# Altium project Pedal_MB.PrjPcb (part 1 of 4)
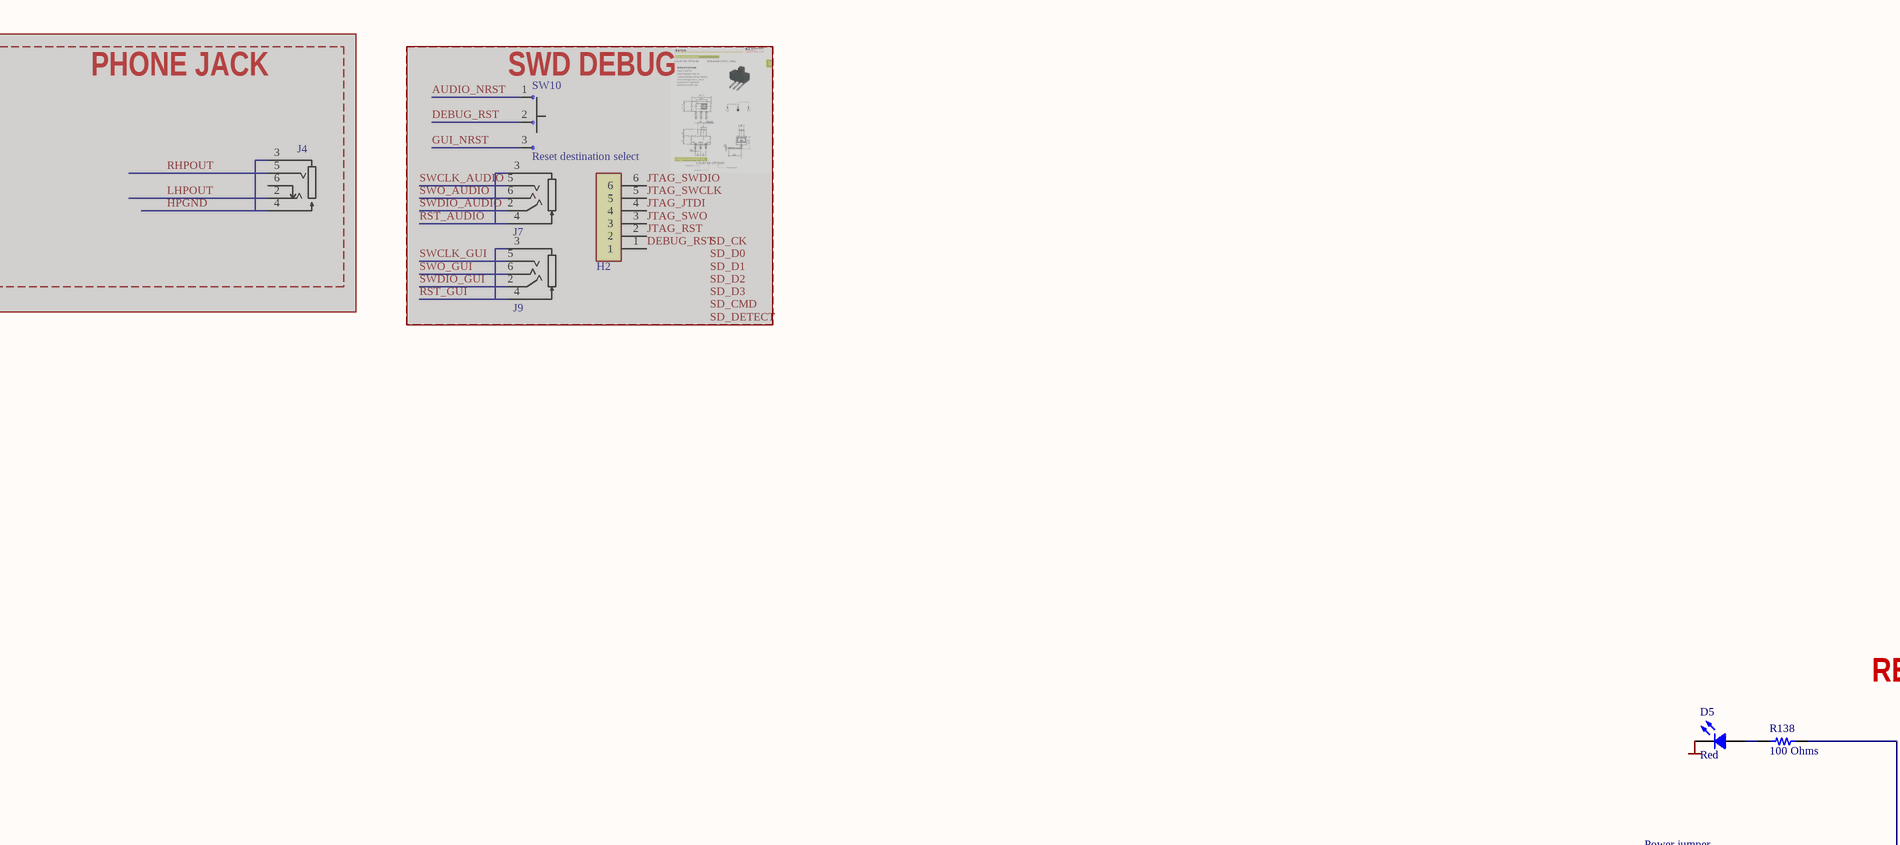
[diagram p0: 3d_dsn_approx.SchDoc, top left]
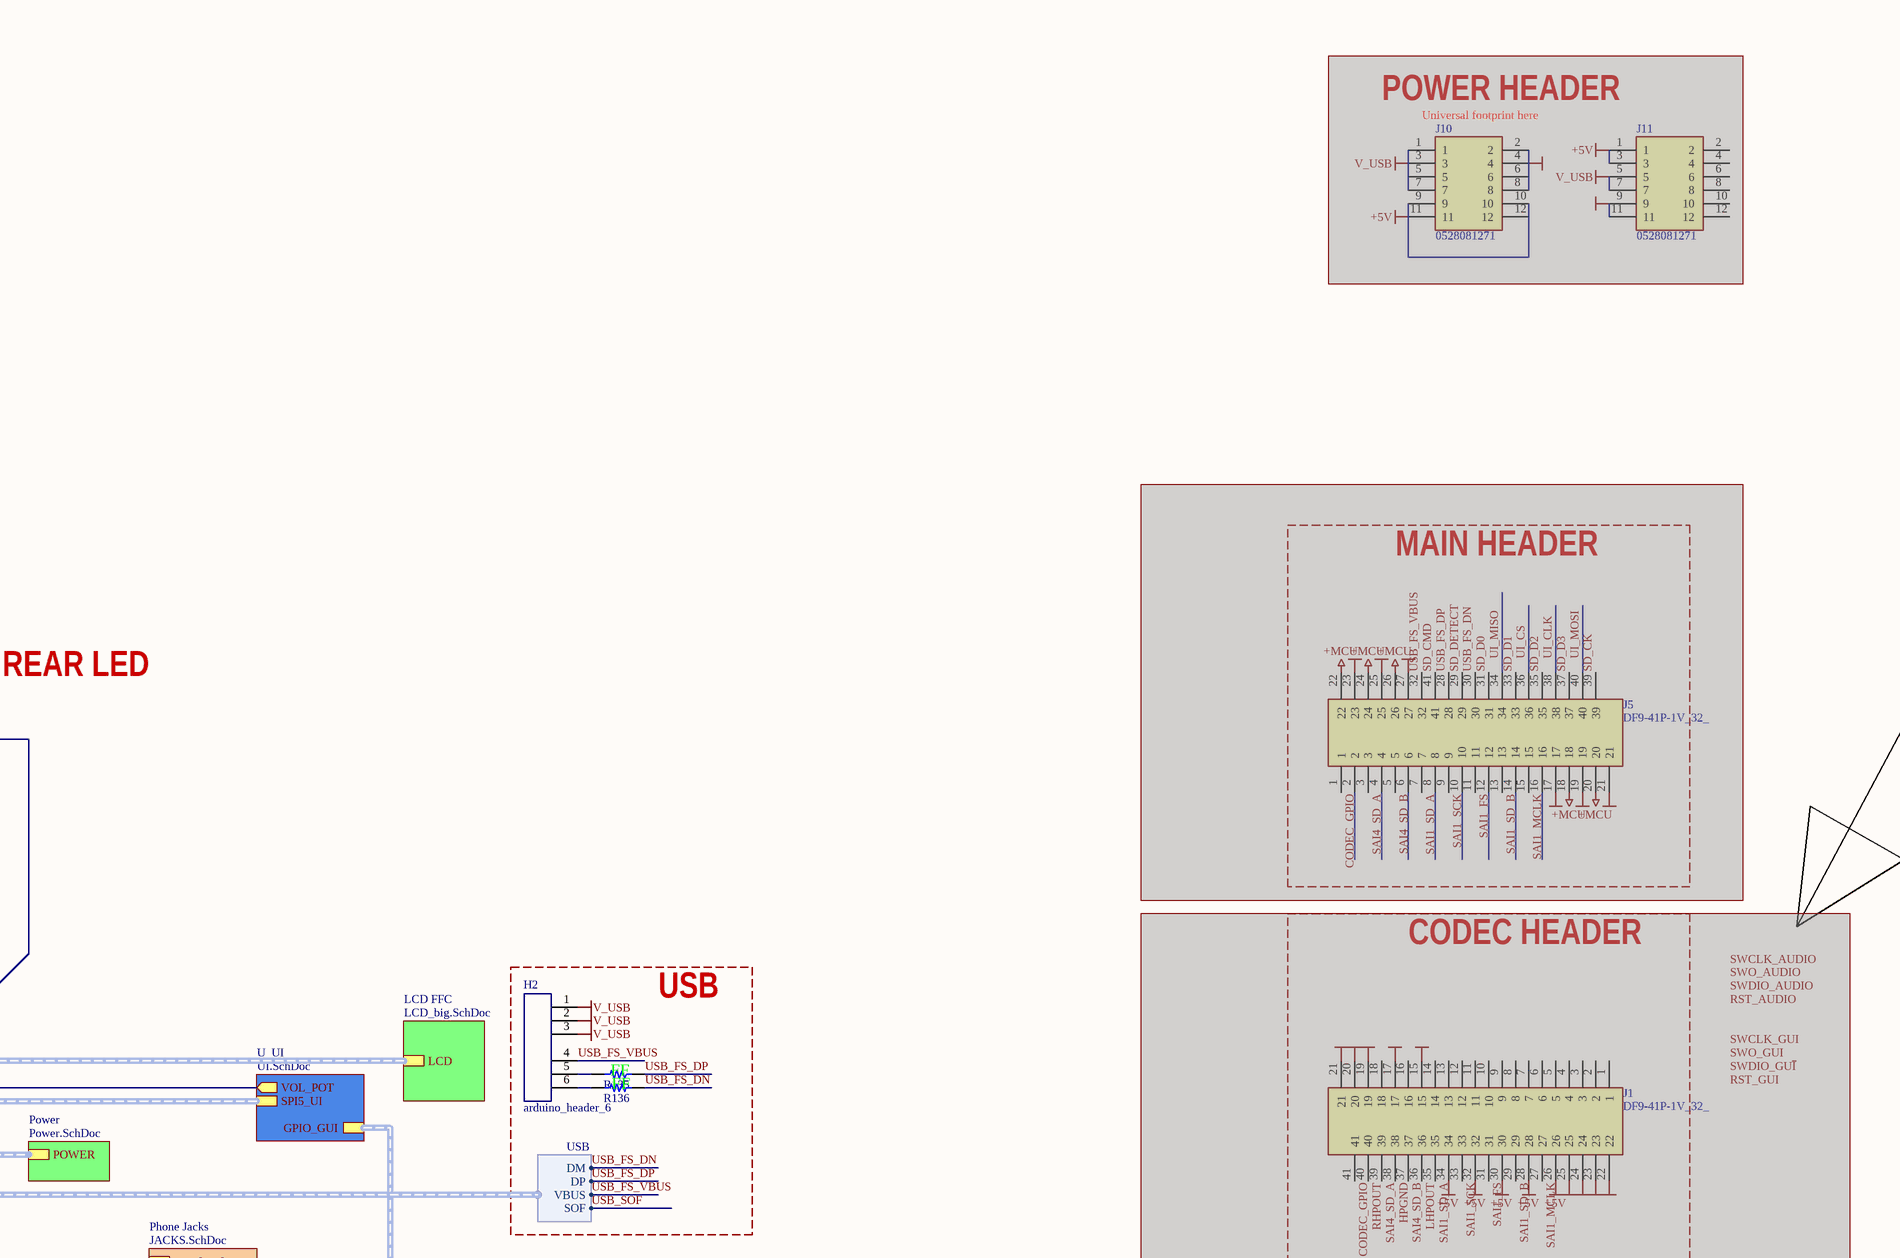
[diagram p1: 3d_dsn_approx.SchDoc, top right]
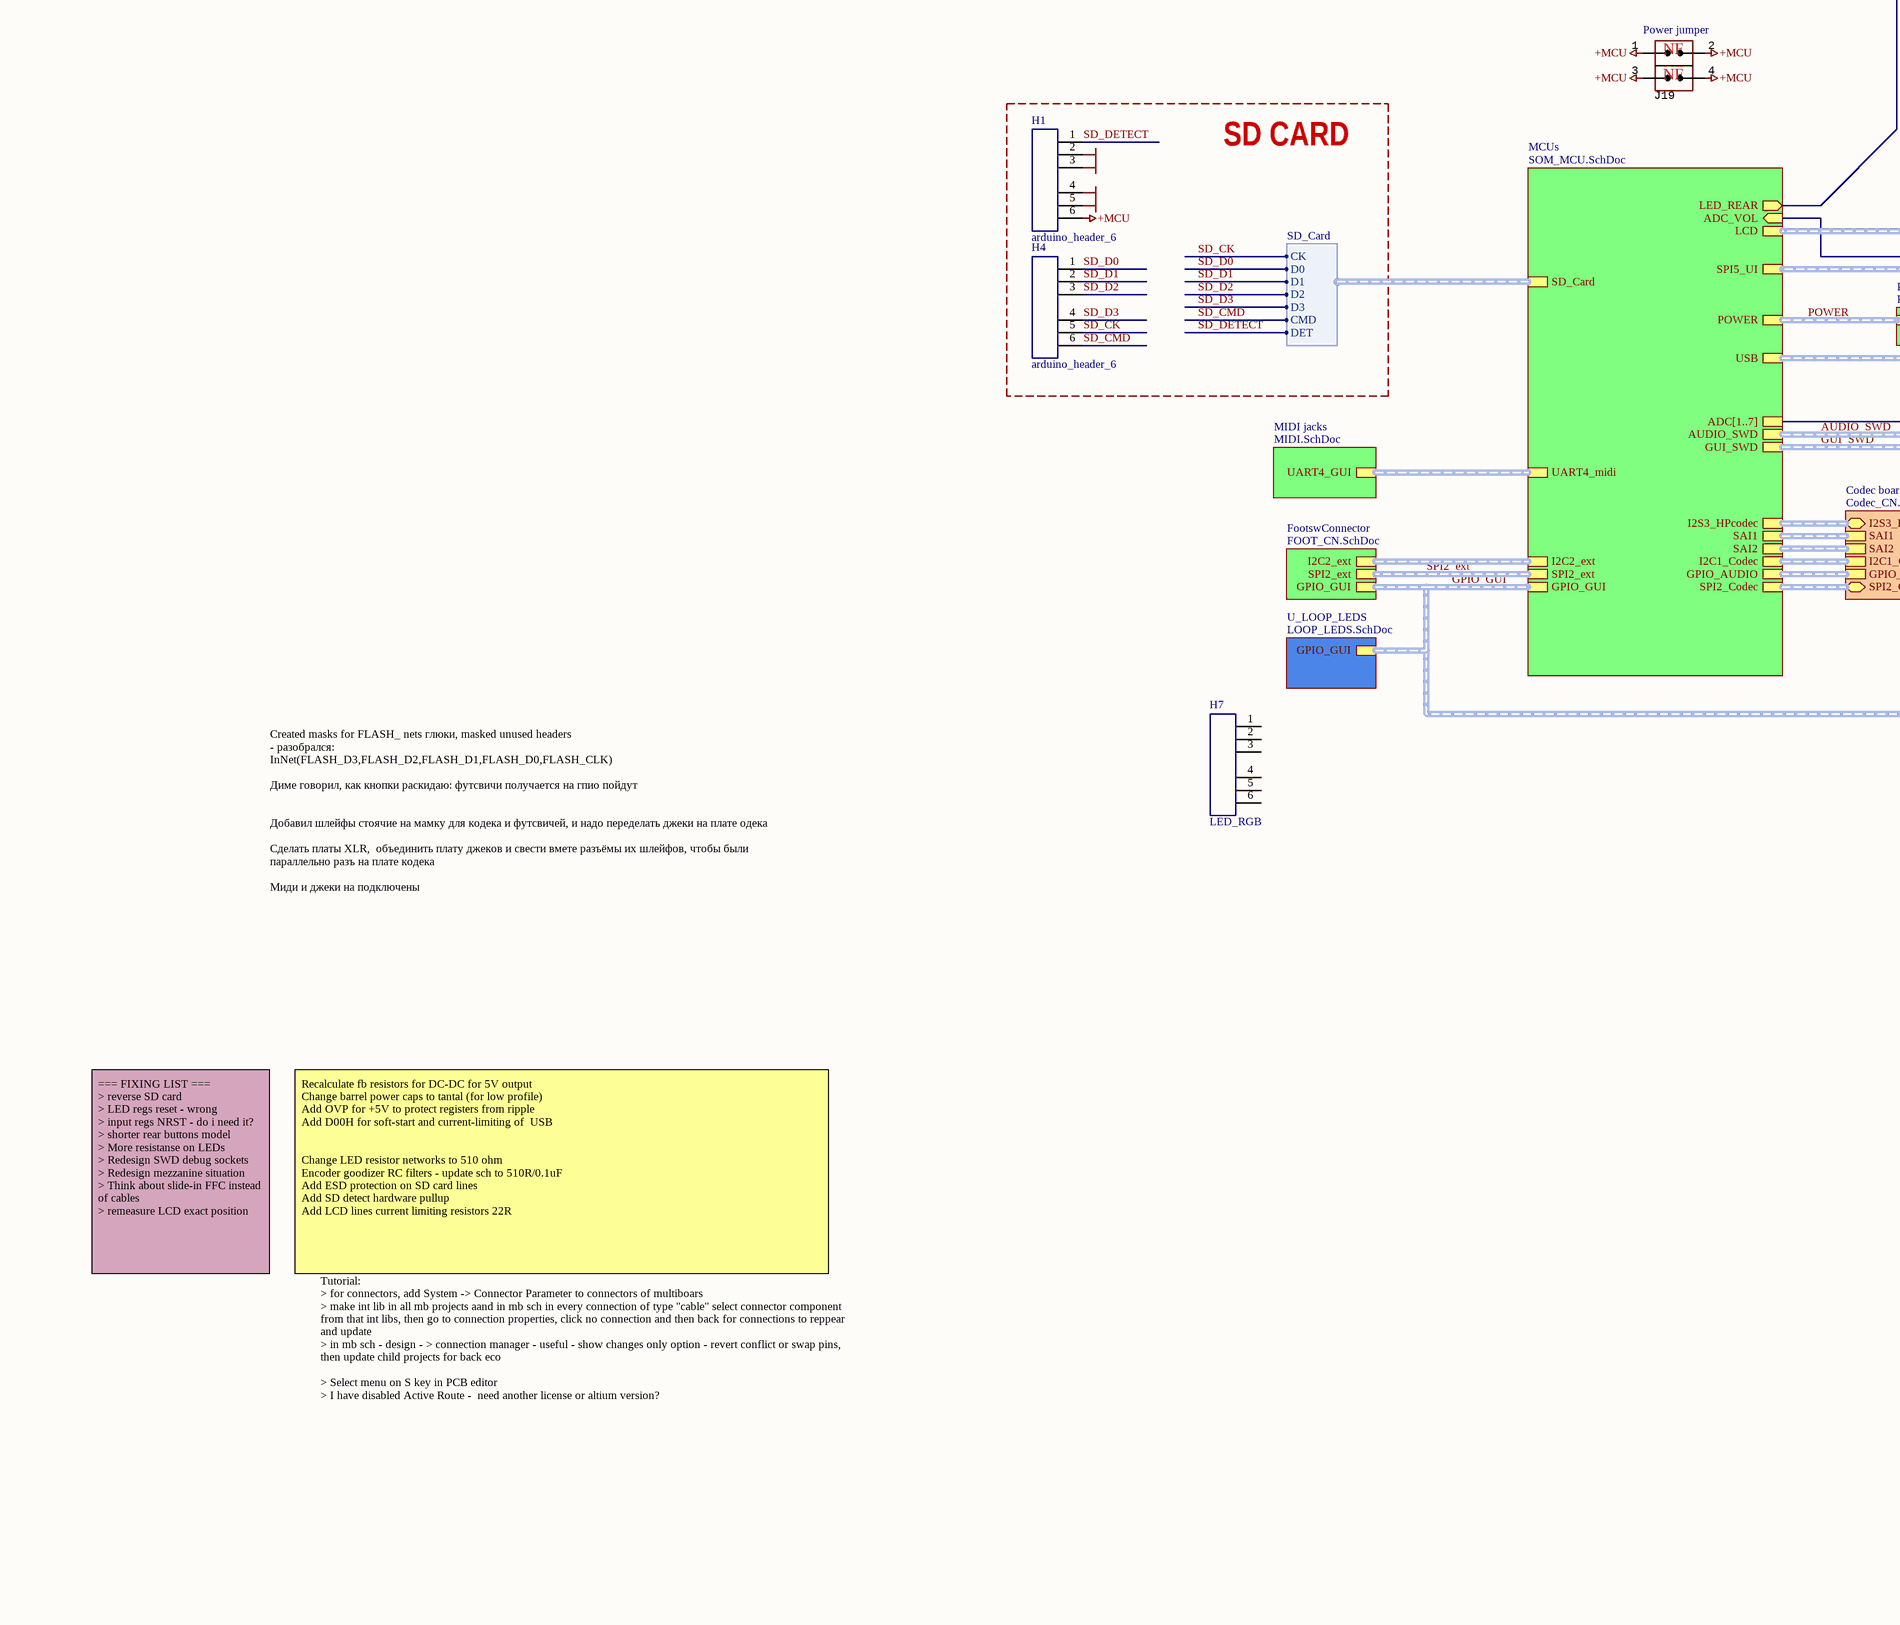
[diagram p2: 3d_dsn_approx.SchDoc, bottom left]
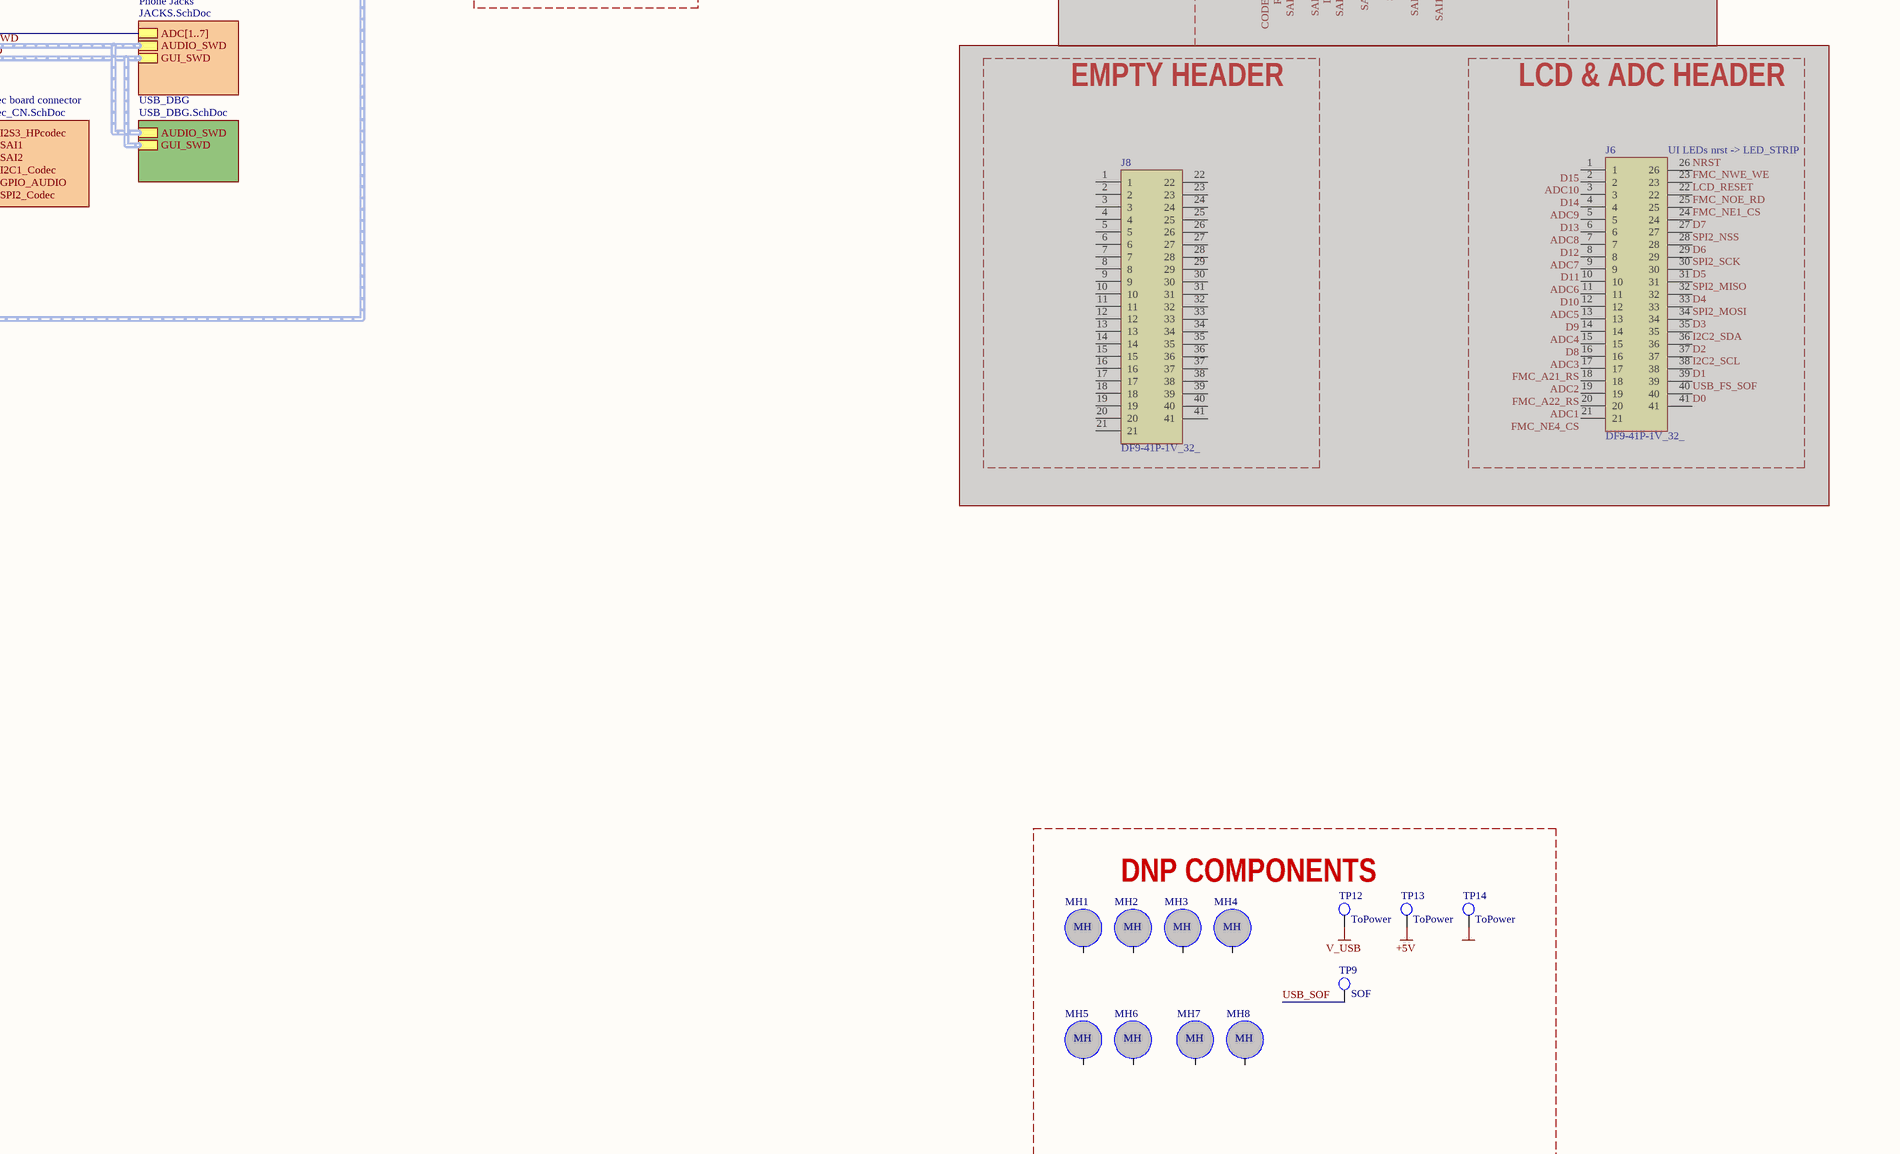
[diagram p3: 3d_dsn_approx.SchDoc, bottom right]
15 sheets, 430 parts. Net scope: hierarchical (ports join the sheet entries above them; power ports are global).
Board files: main.PcbDoc, main_old.PcbDoc
Sheets:
  3d_dsn_approx.SchDoc
    MCUs = SOM_MCU.SchDoc
      MCU_GUI = MCU_GUI.SchDoc
      MCU_AUDIO = MCU_AUDIO.SchDoc
      SPI_LSH = MISO_LSH.SchDoc
    LCD FFC = LCD_big.SchDoc
    FootswConnector = FOOT_CN.SchDoc
    Codec board connector = Codec_CN.SchDoc
    MIDI jacks = MIDI.SchDoc
    Phone Jacks = JACKS.SchDoc
    USB_DBG = USB_DBG.SchDoc
    Power = Power.SchDoc
    U_UI = UI.SchDoc
      IC101 = 74VHCT14AM1.SchDoc
      IC102 = 74VHCT14AM1.SchDoc
      IC103 = 74VHCT14AM1.SchDoc
      IC104 = 74VHCT14AM1.SchDoc
      IC105 = 74VHCT14AM1.SchDoc
    U_LOOP_LEDS = LOOP_LEDS.SchDoc

## Sheet 3d_dsn_approx.SchDoc
size A1; SheetNumber: 1; SheetTotal: 13

### Parts
(Parts that share a designator on the sheet are numbered #1, #2 ... from top to bottom, then left to right.)
D5  Red  [LED 0805_2012 RED]
H1#1  arduino_header_6  [header-6_female]
H2#1  1.5-6A  [1.5-6A]  (value not drawn)  (masked out: inside a compile mask, not in the netlist)
H2#2  arduino_header_6  [header-6_female]
H4  arduino_header_6  [header-6_female]
H7  LED_RGB  [header-6_male]
J1#1  DF9-41P-1V_32_  [HIROSE_DF9-41P-1V(32)]  (masked out: inside a compile mask, not in the netlist)
J4#1  35RASMT2BHNTRX  [PJ_327]  (value not drawn)  (masked out: inside a compile mask, not in the netlist)
J5#1  DF9-41P-1V_32_  [HIROSE_DF9-41P-1V(32)]  (masked out: inside a compile mask, not in the netlist)
J6#1  DF9-41P-1V_32_  [HIROSE_DF9-41P-1V(32)]  (masked out: inside a compile mask, not in the netlist)
J7#1  PJ-327F  [PJ-327F]  (value not drawn)  (masked out: inside a compile mask, not in the netlist)
J8#1  DF9-41P-1V_32_  [HIROSE_DF9-41P-1V(32)]  (masked out: inside a compile mask, not in the netlist)
J9#1  PJ-327F  [PJ-327F]  (value not drawn)  (masked out: inside a compile mask, not in the netlist)
J10#1  0528081271  [AFA11-S12GLA-00]  (masked out: inside a compile mask, not in the netlist)
J11#1  0528081271  [AFA11-S12GLA-00]  (masked out: inside a compile mask, not in the netlist)
J19  (no value)  [CON: JUMPER x2]
MH1  MountingHole  [Hole_2.5mm]  (value not drawn)
MH2  MountingHole  [Hole_2.5mm]  (value not drawn)
MH3  MountingHole  [Hole_2.5mm]  (value not drawn)
MH4  MountingHole  [Hole_2.5mm]  (value not drawn)
MH5  MountingHole  [Hole_2.5mm]  (value not drawn)
MH6  MountingHole  [Hole_2.5mm]  (value not drawn)
MH7  MountingHole  [Hole_2.5mm]  (value not drawn)
MH8  MountingHole  [Hole_2.5mm]  (value not drawn)
R135  (no value)  [RES 0603_1608]
R136  (no value)  [RES 0603_1608]
R138  100 Ohms  [RES 0402_1005]
SW10  Reset destination select  [SLIDE_SW_BIG]  (masked out: inside a compile mask, not in the netlist)
TP9  SOF  [TESTPOINT_PAD]
TP12  ToPower  [TESTPOINT_PAD]
TP13  ToPower  [TESTPOINT_PAD]
TP14  ToPower  [TESTPOINT_PAD]

### Blocks framed on the sheet
PHONE JACK: J4#1
SWD DEBUG: H2#1 J7#1 J9#1 SW10
MAIN HEADER: J5#1
CODEC HEADER: J1#1
SD CARD: H1#1 H4
USB: H2#2 R135 R136
EMPTY HEADER: J8#1
LCD & ADC HEADER: J6#1
DNP COMPONENTS: MH1-MH8 TP9 TP12-TP14

### Sub-sheets
Codec board connector = Codec_CN.SchDoc: SAI1 (harness SAI), SAI2 (harness SAI), I2C1_Codec (harness I2C), GPIO_AUDIO (harness GPIO_AUDIO), I2S3_HPcodec (bidir), SPI2_Codec (bidir)
FootswConnector = FOOT_CN.SchDoc: I2C2_ext (harness I2C), SPI2_ext (harness GPIO_GUI), GPIO_GUI (harness GPIO_GUI)
LCD FFC = LCD_big.SchDoc: LCD (harness LCD)
MCUs = SOM_MCU.SchDoc: SD_Card (harness SD_Card), LCD (harness LCD), I2C2_ext (harness GPIO_GUI), SPI2_ext (harness GPIO_GUI), SPI5_UI (harness USB), USB (harness USB), SAI1, SAI2, I2C1_Codec, GPIO_AUDIO, UART4_midi (harness SD_Card), GUI_SWD (harness SWD), AUDIO_SWD (harness SWD), GPIO_GUI (harness GPIO_GUI), POWER (harness POWER), ADC[1..7], ADC_VOL (in), LED_REAR (out), I2S3_HPcodec, SPI2_Codec
MIDI jacks = MIDI.SchDoc: UART4_GUI (harness UART)
Phone Jacks = JACKS.SchDoc: GUI_SWD (harness SWD), AUDIO_SWD (harness SWD), ADC[1..7]
Power = Power.SchDoc: POWER (harness POWER)
U_LOOP_LEDS = LOOP_LEDS.SchDoc: GPIO_GUI (harness GPIO_GUI)
U_UI = UI.SchDoc: VOL_POT (out), SPI5_UI (harness USB), GPIO_GUI (harness GPIO_GUI)
USB_DBG = USB_DBG.SchDoc: GUI_SWD (harness SWD), AUDIO_SWD (harness SWD)

### Harnesses
SD_Card: CK, D0, D1, D2, D3, CMD, DET
USB: DM, DP, VBUS, SOF

### Nets
+5V: TP13.1
+MCU: H1#1.6 J19.1(IN) J19.2(IN) J19.3(IN) J19.4(IN)
GND: D5.2 H1#1.2 H1#1.3 H1#1.4 H1#1.5 TP14.1
V_USB: H2#2.1 H2#2.2 H2#2.3 TP12.1
ADC_VOL: sheet MCUs/ADC_VOL, sheet U_UI/VOL_POT
LED_REAR: R138.2 ; sheet MCUs/LED_REAR
SD_CK: H4.5 ; sheet MCUs/SD_Card.CK
SD_CMD: H4.6 ; sheet MCUs/SD_Card.CMD
SD_D0: H4.1 ; sheet MCUs/SD_Card.D0
SD_D1: H4.2 ; sheet MCUs/SD_Card.D1
SD_D2: H4.3 ; sheet MCUs/SD_Card.D2
SD_D3: H4.4 ; sheet MCUs/SD_Card.D3
SD_DETECT: H1#1.1 ; sheet MCUs/SD_Card.DET
USB_FS_DN: R136.1 ; sheet MCUs/USB.DM  [project net USB_FS_DM]
USB_FS_DP: R135.1 ; sheet MCUs/USB.DP
USB_FS_VBUS: H2#2.4 ; sheet MCUs/USB.VBUS
USB_SOF: TP9.1 ; sheet MCUs/USB.SOF  [project net USB_FS_SOF]
NetD5_1: D5.1 R138.1
NetH2#2_5: H2#2.5 R135.2
NetH2#2_6: H2#2.6 R136.2

Not connected (* = marked no-connect by the designer): H7 1 2 3 4 5 6; MH1 0; MH2 0; MH3 0; MH4 0; MH5 0; MH6 0; MH7 0; MH8 0

### Buses and harness runs
bus sheet MCUs/ADC[1..7] = sheet Phone Jacks/ADC[1..7]
harness AUDIO_SWD = sheet MCUs/AUDIO_SWD = sheet Phone Jacks/AUDIO_SWD = sheet USB_DBG/AUDIO_SWD
harness GPIO_GUI = sheet FootswConnector/GPIO_GUI = sheet MCUs/GPIO_GUI = sheet U_LOOP_LEDS/GPIO_GUI = sheet U_UI/GPIO_GUI
harness GUI_SWD = sheet MCUs/GUI_SWD = sheet Phone Jacks/GUI_SWD = sheet USB_DBG/GUI_SWD
harness POWER = sheet MCUs/POWER = sheet Power/POWER
harness sheet Codec board connector/GPIO_AUDIO = sheet MCUs/GPIO_AUDIO
harness sheet Codec board connector/I2C1_Codec = sheet MCUs/I2C1_Codec
harness sheet Codec board connector/I2S3_HPcodec = sheet MCUs/I2S3_HPcodec
harness sheet Codec board connector/SAI1 = sheet MCUs/SAI1
harness sheet Codec board connector/SAI2 = sheet MCUs/SAI2
harness sheet Codec board connector/SPI2_Codec = sheet MCUs/SPI2_Codec
harness sheet FootswConnector/I2C2_ext = sheet MCUs/I2C2_ext
harness sheet LCD FFC/LCD = sheet MCUs/LCD
harness sheet MCUs/SPI5_UI = sheet U_UI/SPI5_UI
harness sheet MCUs/UART4_midi = sheet MIDI jacks/UART4_GUI
harness SPI2_ext = sheet FootswConnector/SPI2_ext = sheet MCUs/SPI2_ext

### Notes on the sheet
- POWER HEADER
- (near J10#1) Universal footprint here
- REAR LED
- (near J19) Power jumper
- (near J19) NF
- (near R135) FF
- FF
- (near J6#1) UI LEDs nrst -> LED_STRIP
- Created masks for FLASH_ nets глюки, masked unused headers
  - разобрался:
  InNet(FLASH_D3,FLASH_D2,FLASH_D1,FLASH_D0,FLASH_CLK)
  Диме говорил, как кнопки раскидаю: футсвичи получается на гпио пойдут
  Добавил шлейфы стоячие на мамку для кодека и футсвичей, и надо переделать джеки на плате одека
  Сделать платы XLR,  объединить плату джеков и свести вмете разъёмы их шлейфов, чтобы были параллельно разъ на плате кодека
  Миди и джеки на подключены
- Recalculate fb resistors for DC-DC for 5V output
  Change barrel power caps to tantal (for low profile)
  Add OVP for +5V to protect registers from ripple
  Add D00H for soft-start and current-limiting of  USB
  Change LED resistor networks to 510 ohm
  Encoder goodizer RC filters - update sch to 510R/0.1uF
  Add ESD protection on SD card lines
  Add SD detect hardware pullup
  Add LCD lines current limiting resistors 22R
- Tutorial:
  > for connectors, add System -> Connector Parameter to connectors of multiboars
  > make int lib in all mb projects aand in mb sch in every connection of type "cable" select connector component from that int libs, then go to connection properties, click no connection and then back for connections to reppear and update
  > in mb sch - design - > connection manager - useful - show changes only option - revert conflict or swap pins, then update child projects for back eco
  > Select menu on S key in PCB editor
  > I have disabled Active Route -  need another license or altium version?
- (in symbol MountingHole) MH

### Library data of the parts
D5 = LSM0805412V: LED RED CLEAR 0805 SMD; Manufacturer: Visual Communications Company - VCC; Configuration: 0805; Current - Test: 20mA; Lens Color: Colorless; Lens Size: 1.40mm x 1.20mm; Lens Style: Rectangle with Flat Top; Millicandela Rating: 100mcd; Viewing Angle: 120°; Voltage - Forward (Vf) (Typ): 2V; Wavelength - Dominant: 625nm; Part Number: LSM0805412V; Color: Red; ComponentLink1Description: Datasheet; ComponentLink1URL: https://www.vcclite.com/wp-content/uploads/wpallimport/files/files/LSM0805452V-Green-Datasheet.pdf; ComponentLink2Description: DigiKey Link; ComponentLink2URL: https://www.digikey.com/en/products/detail/visual-communications-company-vcc/LSM0805412V/10229616; Device Package: 0805 (2012 Metric); Height (Max): 0.90mm; LastUpdated: 6/3/2024 8:00:06 PM; Lens Transparency: Clear; Lifecycle Status: Active; Minimum Order: 1; Mounting Type: Surface Mount; Package / Case: 0805 (2012 Metric); Packaging: TapeAndReel; PartId: 336; Part Status: Active; Price: 0.11; Series: LSM0805; Size / Dimension: 2.00mm L x 1.25mm W; Supplier 1: DigiKey; Supplier Part Number 1: 28-LSM0805412VCT-ND; Supplier Device Package: 0805; Value: Red; Wavelength - Peak: 625nm
H1#1 H2#2 H4 H7 = arduino_header_6: System: Connector
H2#1 = 1.5-6A: Pin Header p=1.5mm, 6 pins
J1#1 J5#1 J6#1 J8#1 = DF9-41P-1V_32_: Connector; Manufacturer_Name: Hirose; Manufacturer_Part_Number: DF9-41P-1V(32); Datasheet Link: http://componentsearchengine.com/Datasheets/1/DF9-41P-1V(32).pdf; Mouser Part Number: 798-DF9-41P-1V32; Mouser Price/Stock: https://www.mouser.co.uk/ProductDetail/Hirose-Connector/DF9-41P-1V32?qs=zOgoZG1CgI%252BzVCgniEkwOw%3D%3D; Arrow Part Number: DF9-41P-1V(32); Arrow Price/Stock: https://www.arrow.com/en/products/df9-41p-1v-32/hirose-electric
J4#1 = 3.5mm jack stereo smd: Conn 3.5MM Stereo Jack F 3 POS Solder RA SMD 3 Terminal 1 Port T/R; MF: Switchcraft; MP: 35RASMT2BHNTRX; Package: None; Price: 0.84 USD; Availability: Good; SnapEDA_Link: https://www.snapeda.com/parts/35RASMT2BHNTRX/Switchcraft%20Inc./view-part/?ref=snap; Value: *
J7#1 J9#1 = 3.5mm jack 4pos smd: PJ-327F 4 contacts 5 pins 1 sw
J10#1 J11#1 = 0528081271: Connector; Manufacturer_Name: Molex; Datasheet Link: https://www.molex.com/pdm_docs/sd/528082071_sd.pdf; Height: 5.3mm; Manufacturer_Part_Number: 0528081271; System: Connector
J19 = Jumper_double: CommentText: "Перемычка"
R135 R136 = RCA06030000ZSEA: RES SMD 0 OHM JUMPER 1/10W 0603; Manufacturer: Vishay Dale; Power (Watts): 0.1W, 1/10W; Part Number: RCA06030000ZSEA; ComponentLink1Description: Datasheet; ComponentLink1URL: http://www.vishay.com/docs/20037/rcae3.pdf; ComponentLink2Description: DigiKey Link; ComponentLink2URL: http://digikey.com/product-detail/en/vishay-dale/RCA06030000ZSEA/541-2192-1-ND/4946845; Composition: Thick Film; Device Package: 0603 (1608 Metric); Features: Anti-Sulfur, Automotive AEC-Q200; Height - Seated (Max): 0.020" (0.50mm); LastUpdated: 9/2/2020 1:10:23 AM; Lifecycle Status: Active; Minimum Order: 1; Number of Terminations: 2; Operating Temperature: -55°C ~ 155°C; Package / Case: 0603 (1608 Metric); Packaging: TapeAndReel; PartId: 5740; Part Status: Active; Price: 0.01; Ratings: AEC-Q200; Series: RCA; Size / Dimension: 0.061" L x 0.033" W (1.55mm x 0.85mm); Supplier 1: DigiKey; Supplier Part Number 1: 541-2192-1-ND; Supplier Device Package: 0603; Tolerance: Jumper
R138 = CRCW0402100RFKEE: RES SMD 100 OHM 1% 1/16W 0402; Manufacturer: Vishay Dale; Power (Watts): 0.063W, 1/16W; Temperature Coefficient: ±100ppm/°C; Part Number: CRCW0402100RFKEE; Value: 100 Ohms; ComponentLink1Description: Datasheet; ComponentLink1URL: http://www.vishay.com/docs/20035/dcrcwe3.pdf; ComponentLink2Description: DigiKey Link; ComponentLink2URL: https://www.digikey.com/en/products/detail/vishay-dale/CRCW0402100RFKEE/5069886; Composition: Thick Film; Device Package: 0402 (1005 Metric); Height - Seated (Max): 0.016" (0.40mm); LastUpdated: 2/9/2024 8:30:05 PM; Lifecycle Status: Active; Minimum Order: 1; Number of Terminations: 2; Operating Temperature: -55°C ~ 155°C; Package / Case: 0402 (1005 Metric); Packaging: CutTape; PartId: 6830; Part Status: Active; Price: 0.01; Resistance: 100 Ohms; Series: CRCW; Size / Dimension: 0.039" L x 0.020" W (1.00mm x 0.50mm); Supplier 1: DigiKey; Supplier Part Number 1: 541-2953-1-ND; Supplier Device Package: 0402; Tolerance: ±1%; Features: Automotive AEC-Q200; Ratings: AEC-Q200
SW10 = RockerSwitch_3mm: Slide switch L-KLS7-SS-12F19-G5
TP9 TP12-TP14 = TestPoint

## Sheet SOM_MCU.SchDoc
size A3; SheetNumber: 5; SheetTotal: 13
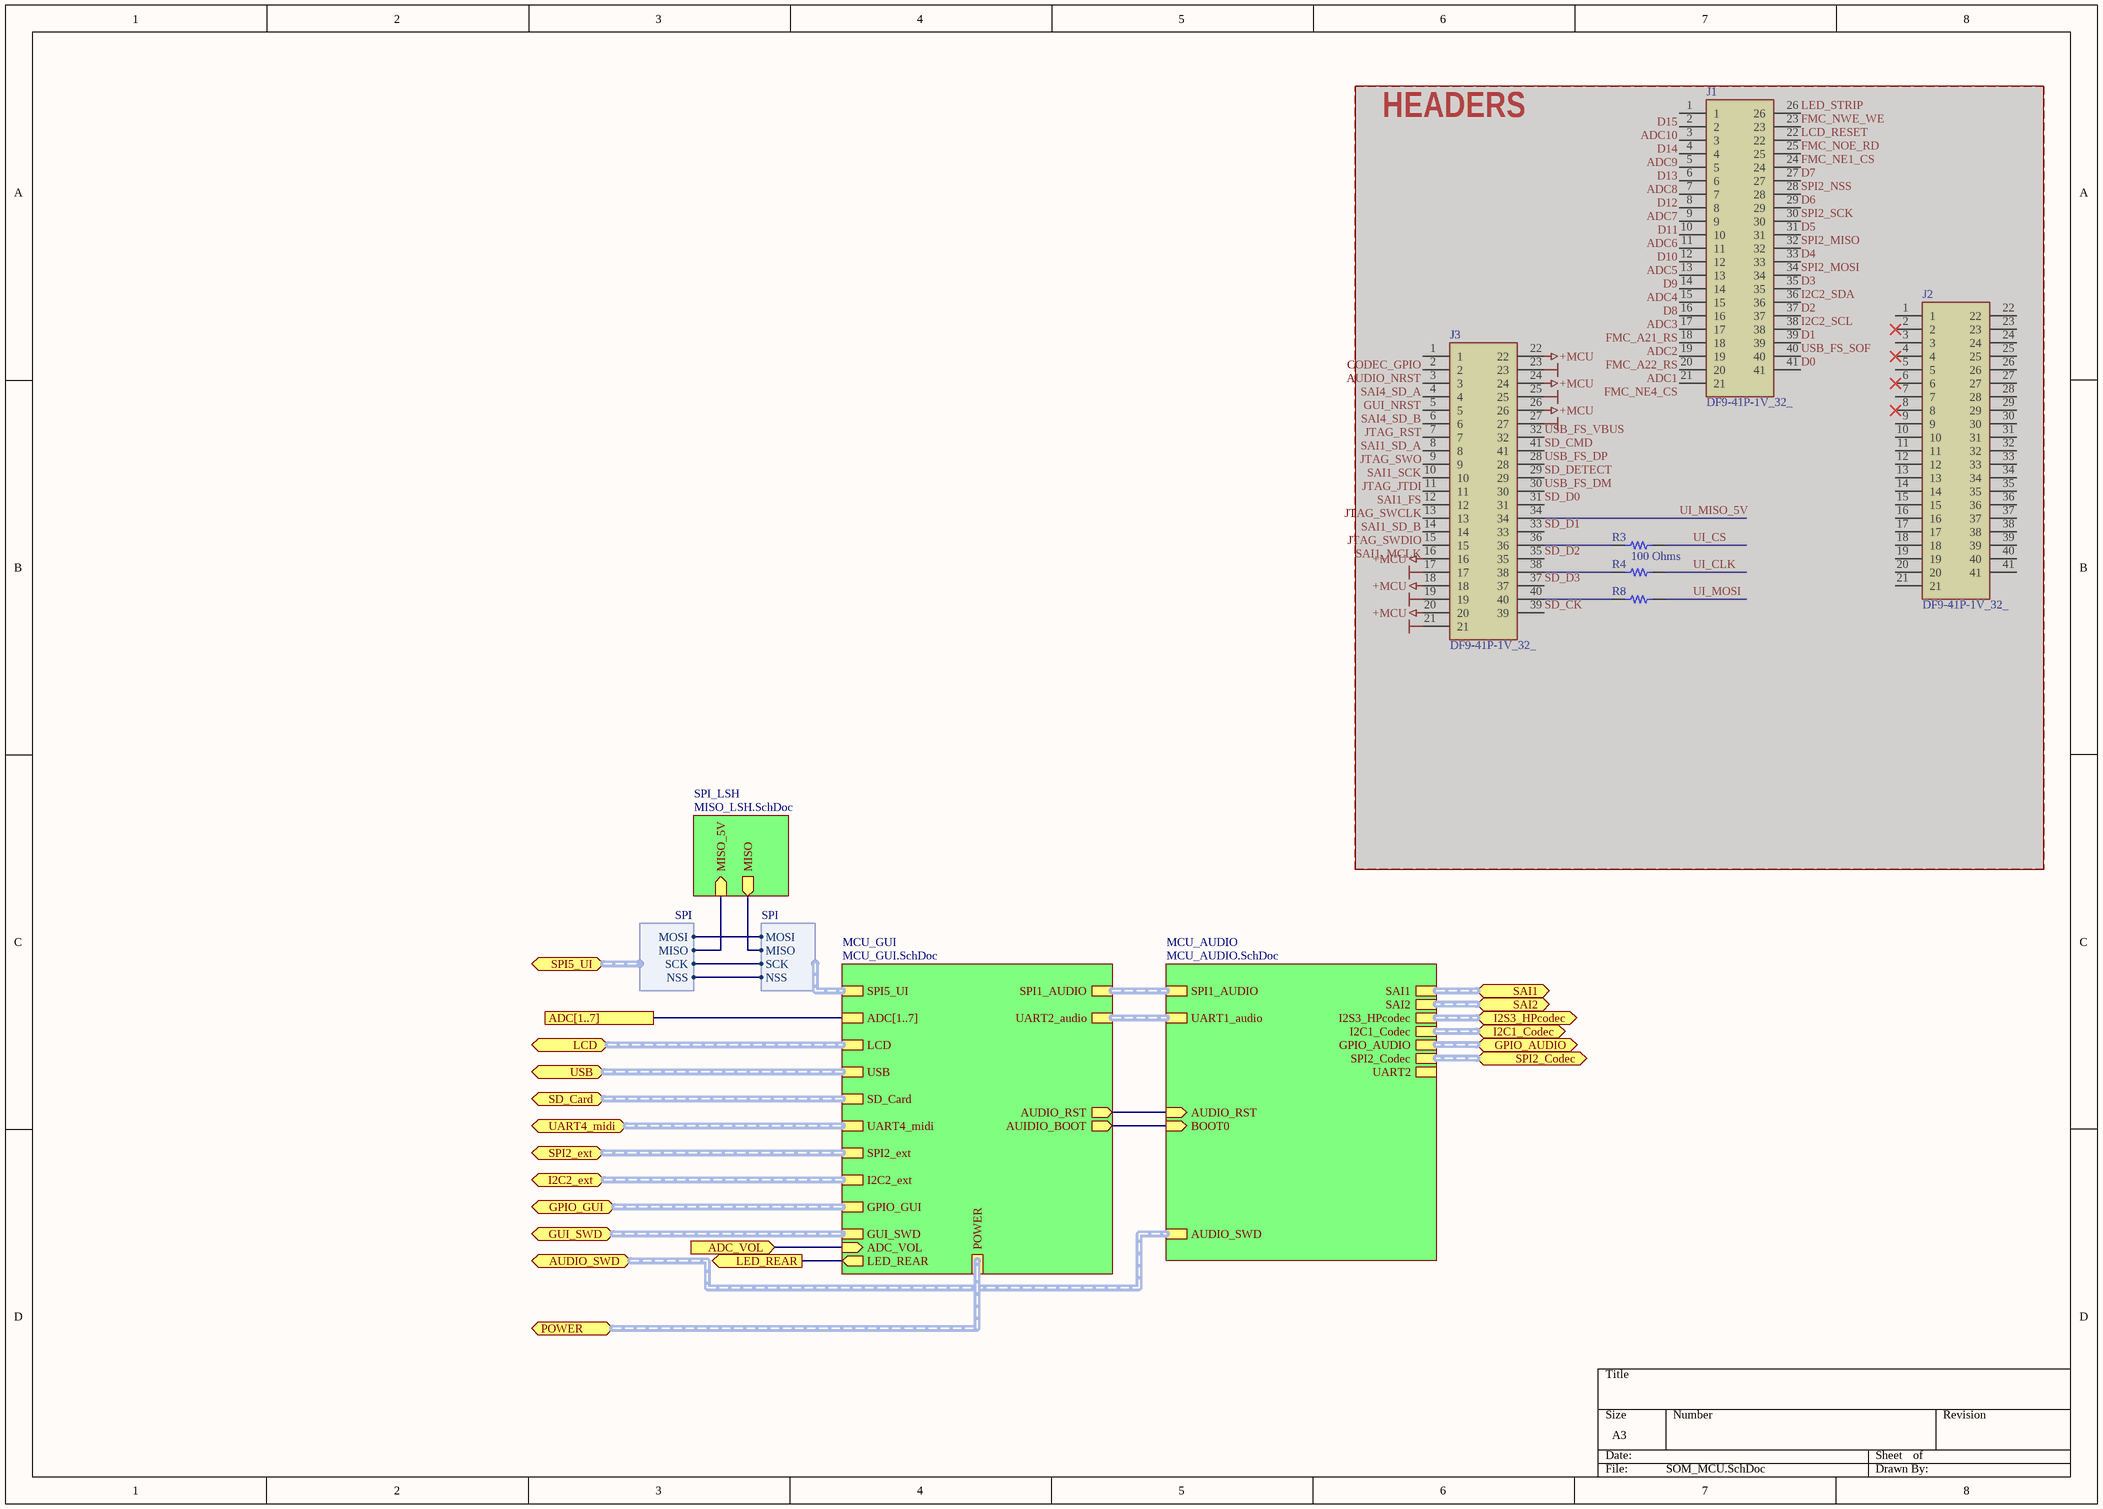
[diagram p4: SOM_MCU.SchDoc]

### Parts
(Parts that share a designator on the sheet are numbered #1, #2 ... from top to bottom, then left to right.)
J1#2  DF9-41P-1V_32_  [HIROSE_DF9-41P-1V(32)]  (masked out: inside a compile mask, not in the netlist)
J2#1  DF9-41P-1V_32_  [HIROSE_DF9-41P-1V(32)]  (masked out: inside a compile mask, not in the netlist)
J3#1  DF9-41P-1V_32_  [HIROSE_DF9-41P-1V(32)]  (masked out: inside a compile mask, not in the netlist)
R3#1  100 Ohms  [RES 0402_1005]  (masked out: inside a compile mask, not in the netlist)
R4#1  100 Ohms  [RES 0402_1005]  (value not drawn)  (masked out: inside a compile mask, not in the netlist)
R8#1  100 Ohms  [RES 0402_1005]  (value not drawn)  (masked out: inside a compile mask, not in the netlist)

### Blocks framed on the sheet
HEADERS: J1#2 J2#1 J3#1 R3#1 R4#1 R8#1

### Sub-sheets
MCU_AUDIO = MCU_AUDIO.SchDoc: I2C1_Codec (harness I2C), SPI1_AUDIO (harness SPI), SAI1 (harness SAI), GPIO_AUDIO (harness GPIO_AUDIO), SAI2 (harness SAI), UART1_audio (harness UART), BOOT0 (in), AUDIO_SWD (harness SWD), AUDIO_RST (in), I2S3_HPcodec (harness SAI), UART2 (harness UART), SPI2_Codec (harness SPI)
MCU_GUI = MCU_GUI.SchDoc: LCD (harness LCD), USB (harness USB), SD_Card (harness SD_Card), SPI1_AUDIO (harness SPI), SPI5_UI (harness SPI), UART2_audio (harness UART), SPI2_ext (harness SPI), I2C2_ext (harness I2C), GPIO_GUI (harness GPIO_GUI), AUDIO_RST (out), AUIDIO_BOOT (out), UART4_midi (harness UART), GUI_SWD (harness SWD), POWER (harness POWER), ADC[1..7], ADC_VOL (in), LED_REAR (out)
SPI_LSH = MISO_LSH.SchDoc: MISO_5V (in), MISO (out)

### Ports
ADC[1..7], ADC_VOL (in), AUDIO_SWD (bidir, harness SWD), GPIO_AUDIO (bidir), GPIO_GUI (bidir, harness GPIO_GUI), GUI_SWD (bidir, harness SWD), I2C1_Codec (bidir), I2C2_ext (bidir, harness I2C), I2S3_HPcodec (bidir), LCD (bidir, harness LCD), LED_REAR (out), POWER (bidir, harness POWER), SAI1 (bidir), SAI2 (bidir), SD_Card (bidir, harness SD_Card), SPI2_Codec (bidir), SPI2_ext (bidir, harness SPI), SPI5_UI (bidir, harness SPI), UART4_midi (bidir, harness SD_Card), USB (bidir, harness USB)

### Harnesses
SPI: MOSI, MISO, SCK, NSS

### Nets
ADC_VOL: port ADC_VOL, sheet MCU_GUI/ADC_VOL
AUDIO_BOOT: sheet MCU_GUI/AUIDIO_BOOT, sheet MCU_AUDIO/BOOT0
AUDIO_RST: sheet MCU_GUI/AUDIO_RST, sheet MCU_AUDIO/AUDIO_RST
LED_REAR: port LED_REAR, sheet MCU_GUI/LED_REAR
SPI5_MISO: sheet SPI_LSH/MISO, sheet MCU_GUI/SPI5_UI.MISO
SPI5_MOSI: sheet MCU_GUI/SPI5_UI.MOSI, port SPI5_UI.MOSI
SPI5_NSS: sheet MCU_GUI/SPI5_UI.NSS, port SPI5_UI.NSS
SPI5_SCK: sheet MCU_GUI/SPI5_UI.SCK, port SPI5_UI.SCK
UI_MISO: sheet SPI_LSH/MISO_5V, port SPI5_UI.MISO

### Buses and harness runs
bus port ADC[1..7] = sheet MCU_GUI/ADC[1..7]
harness port AUDIO_SWD = sheet MCU_AUDIO/AUDIO_SWD
harness port GPIO_AUDIO = sheet MCU_AUDIO/GPIO_AUDIO
harness port GPIO_GUI = sheet MCU_GUI/GPIO_GUI
harness port GUI_SWD = sheet MCU_GUI/GUI_SWD
harness port I2C1_Codec = sheet MCU_AUDIO/I2C1_Codec
harness port I2C2_ext = sheet MCU_GUI/I2C2_ext
harness port I2S3_HPcodec = sheet MCU_AUDIO/I2S3_HPcodec
harness port LCD = sheet MCU_GUI/LCD
harness port POWER = sheet MCU_GUI/POWER
harness port SAI1 = sheet MCU_AUDIO/SAI1
harness port SAI2 = sheet MCU_AUDIO/SAI2
harness port SD_Card = sheet MCU_GUI/SD_Card
harness port SPI2_Codec = sheet MCU_AUDIO/SPI2_Codec
harness port SPI2_ext = sheet MCU_GUI/SPI2_ext
harness port UART4_midi = sheet MCU_GUI/UART4_midi
harness port USB = sheet MCU_GUI/USB
harness sheet MCU_AUDIO/SPI1_AUDIO = sheet MCU_GUI/SPI1_AUDIO
harness sheet MCU_AUDIO/UART1_audio = sheet MCU_GUI/UART2_audio

### Library data of the parts
J1#2 J2#1 J3#1 = DF9-41P-1V_32_: as J1#1 on sheet 3d_dsn_approx; Datasheet Link: http://componentsearchengine.com/Datasheets/1/DF9-41P-1V(32).pdf; Mouser Part Number: 798-DF9-41P-1V32; Mouser Price/Stock: https://www.mouser.co.uk/ProductDetail/Hirose-Connector/DF9-41P-1V32?qs=zOgoZG1CgI%252BzVCgniEkwOw%3D%3D; Arrow Part Number: DF9-41P-1V(32); Arrow Price/Stock: https://www.arrow.com/en/products/df9-41p-1v-32/hirose-electric
R3#1 R4#1 R8#1 = CRCW0402100RFKEE: as R138 on sheet 3d_dsn_approx; Part Number: CRCW0402100RFKEE; Value: 100 Ohms; ComponentLink1Description: Datasheet; ComponentLink1URL: http://www.vishay.com/docs/20035/dcrcwe3.pdf; ComponentLink2Description: DigiKey Link; ComponentLink2URL: https://www.digikey.com/en/products/detail/vishay-dale/CRCW0402100RFKEE/5069886; Composition: Thick Film; Device Package: 0402 (1005 Metric); Height - Seated (Max): 0.016" (0.40mm); LastUpdated: 2/9/2024 8:30:05 PM; Lifecycle Status: Active; Minimum Order: 1; Number of Terminations: 2; Operating Temperature: -55°C ~ 155°C; Package / Case: 0402 (1005 Metric); Packaging: CutTape; PartId: 6830; Part Status: Active; Price: 0.01; Resistance: 100 Ohms; Series: CRCW; Size / Dimension: 0.039" L x 0.020" W (1.00mm x 0.50mm); Supplier 1: DigiKey; Supplier Part Number 1: 541-2953-1-ND; Supplier Device Package: 0402; Tolerance: ±1%; Features: Automotive AEC-Q200; Ratings: AEC-Q200

## Sheet MCU_GUI.SchDoc
size A1; SheetNumber: 6; SheetTotal: 13
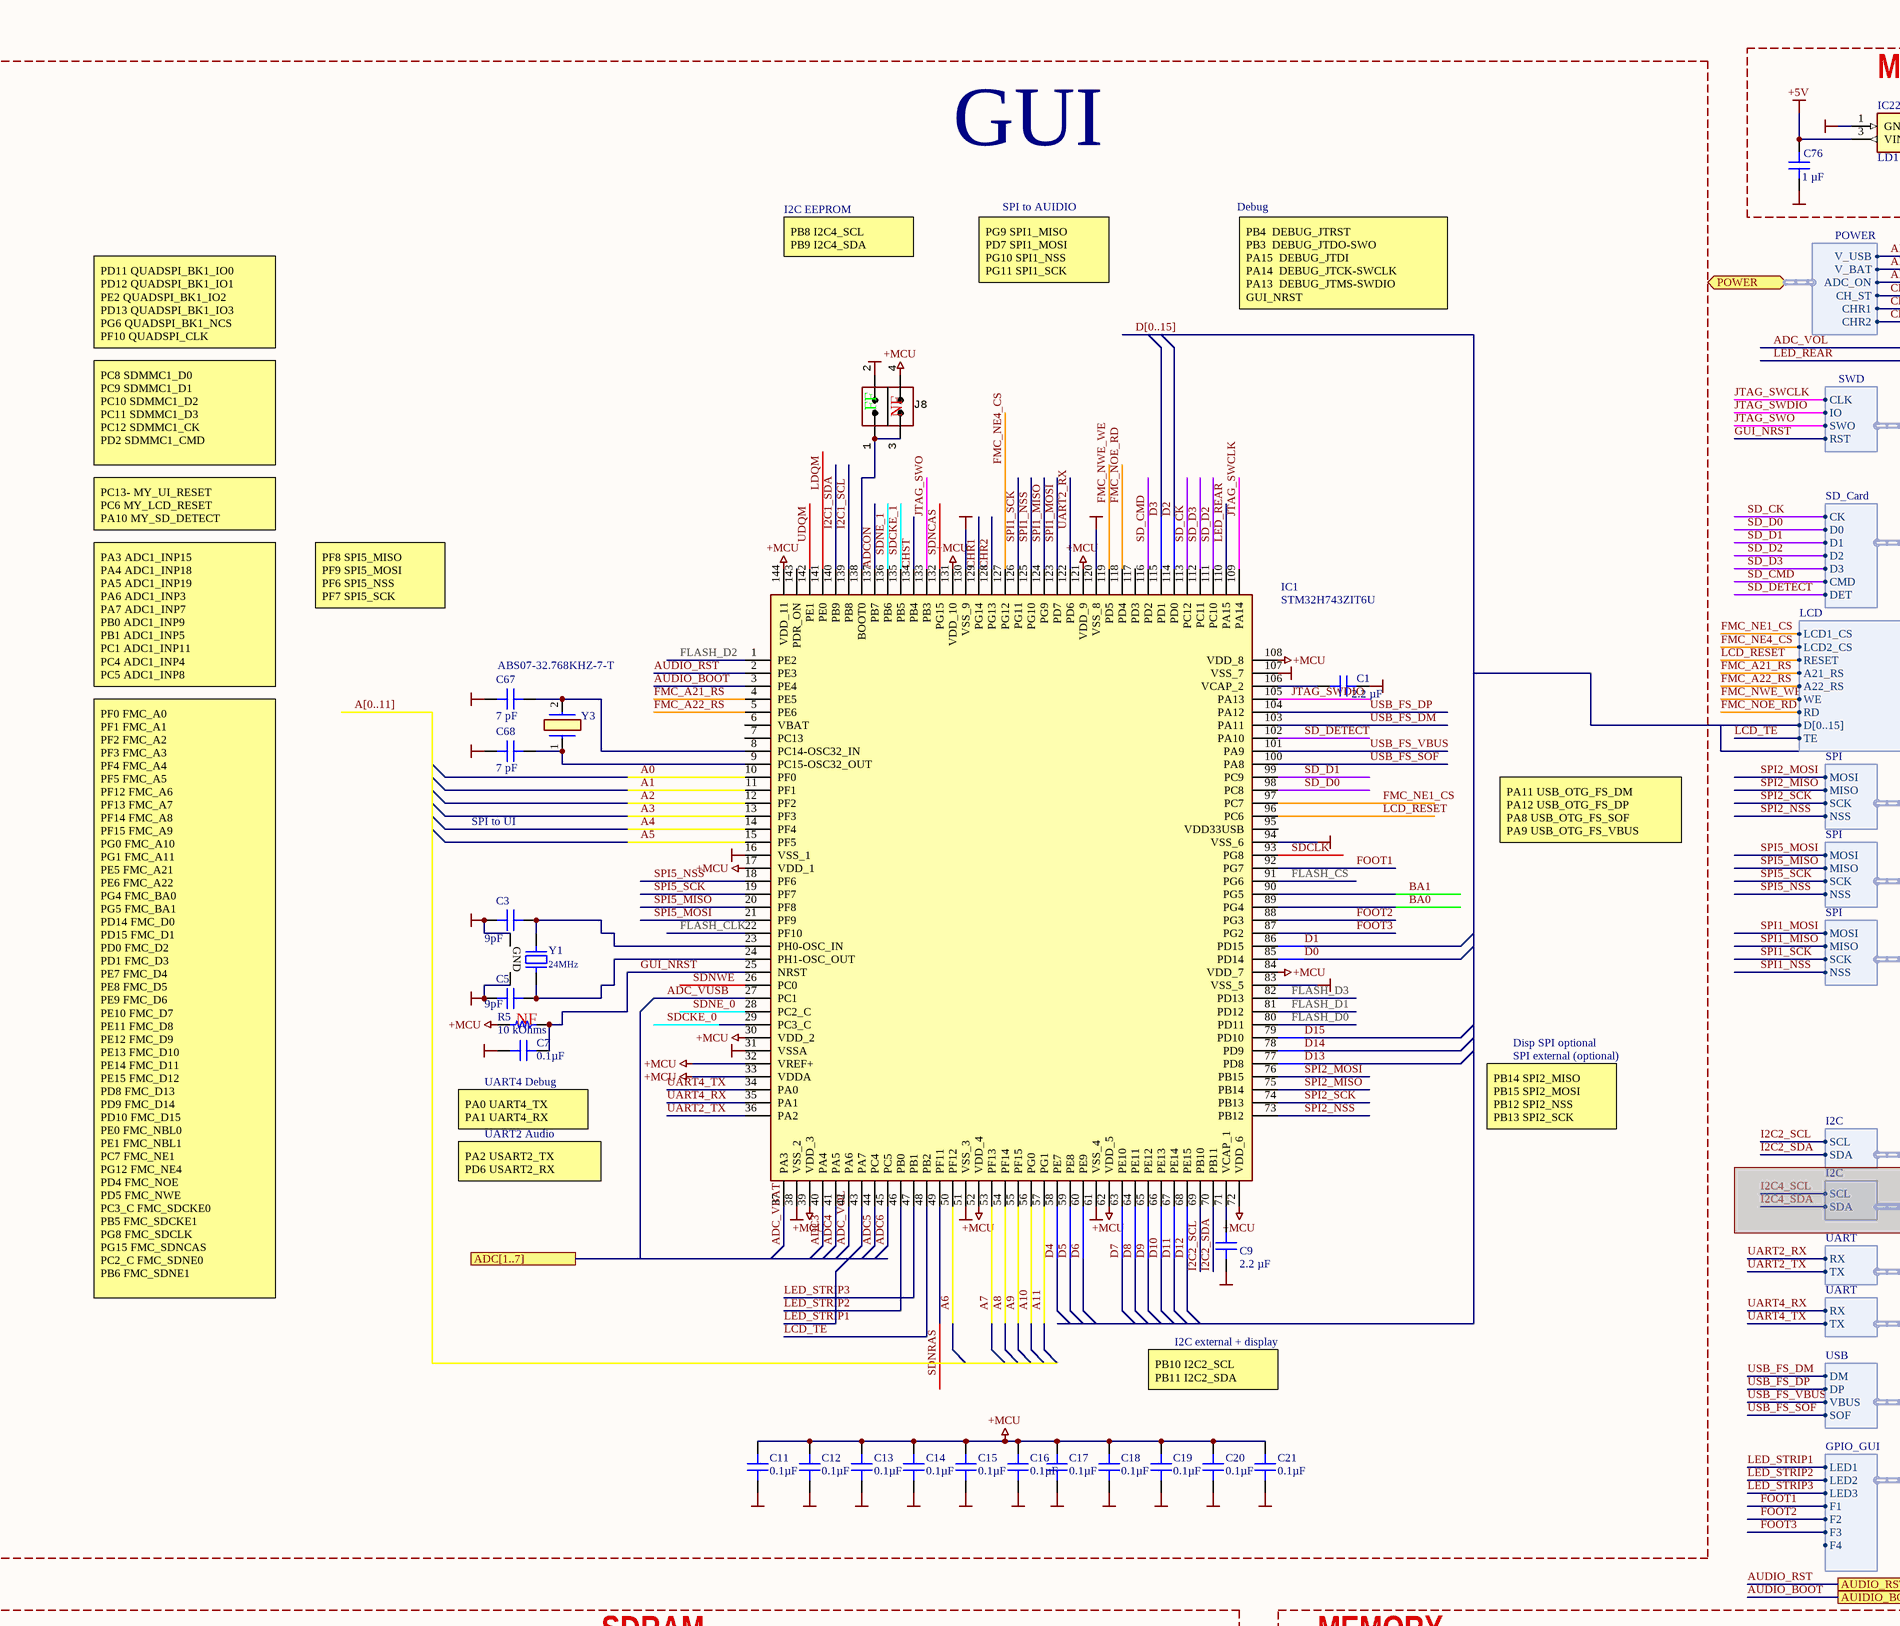
[diagram p5: MCU_GUI.SchDoc, top left]
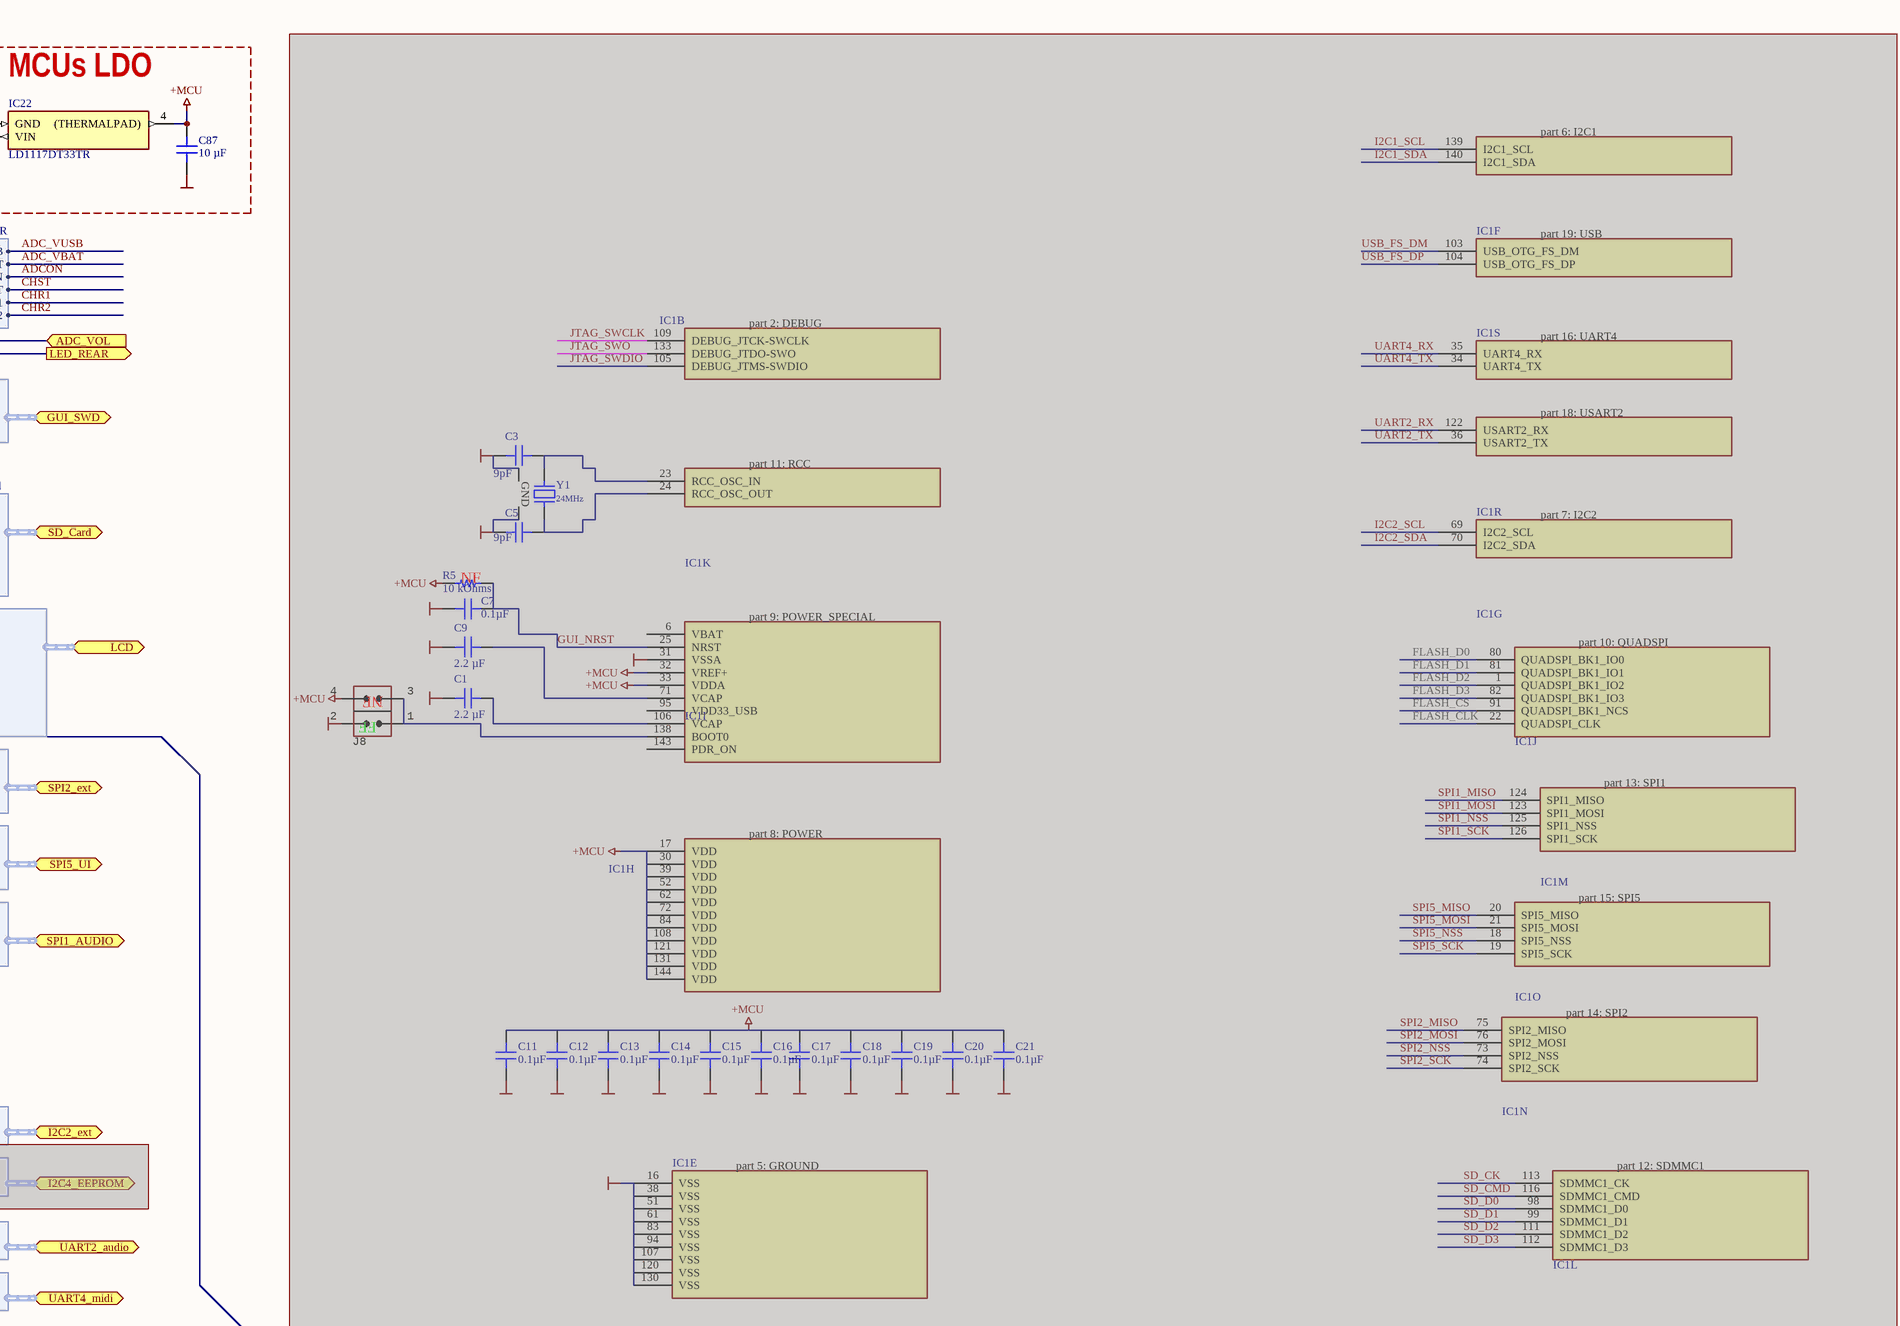
[diagram p6: MCU_GUI.SchDoc, top right]
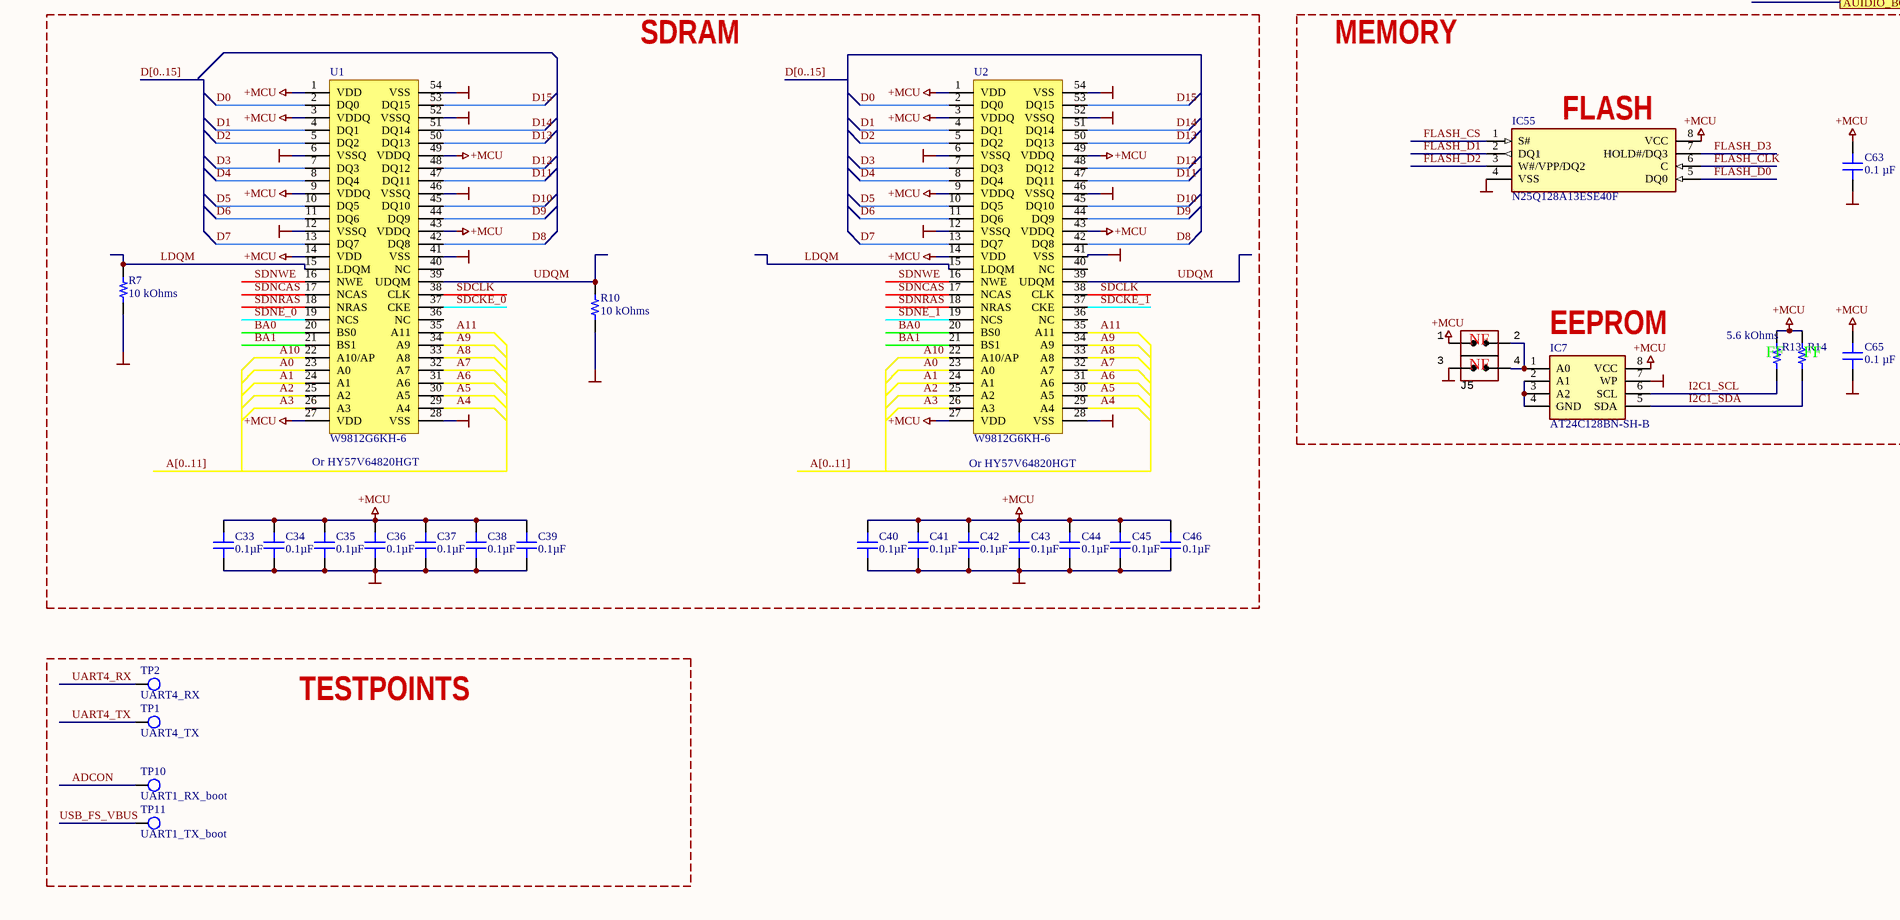
[diagram p7: MCU_GUI.SchDoc, bottom left]
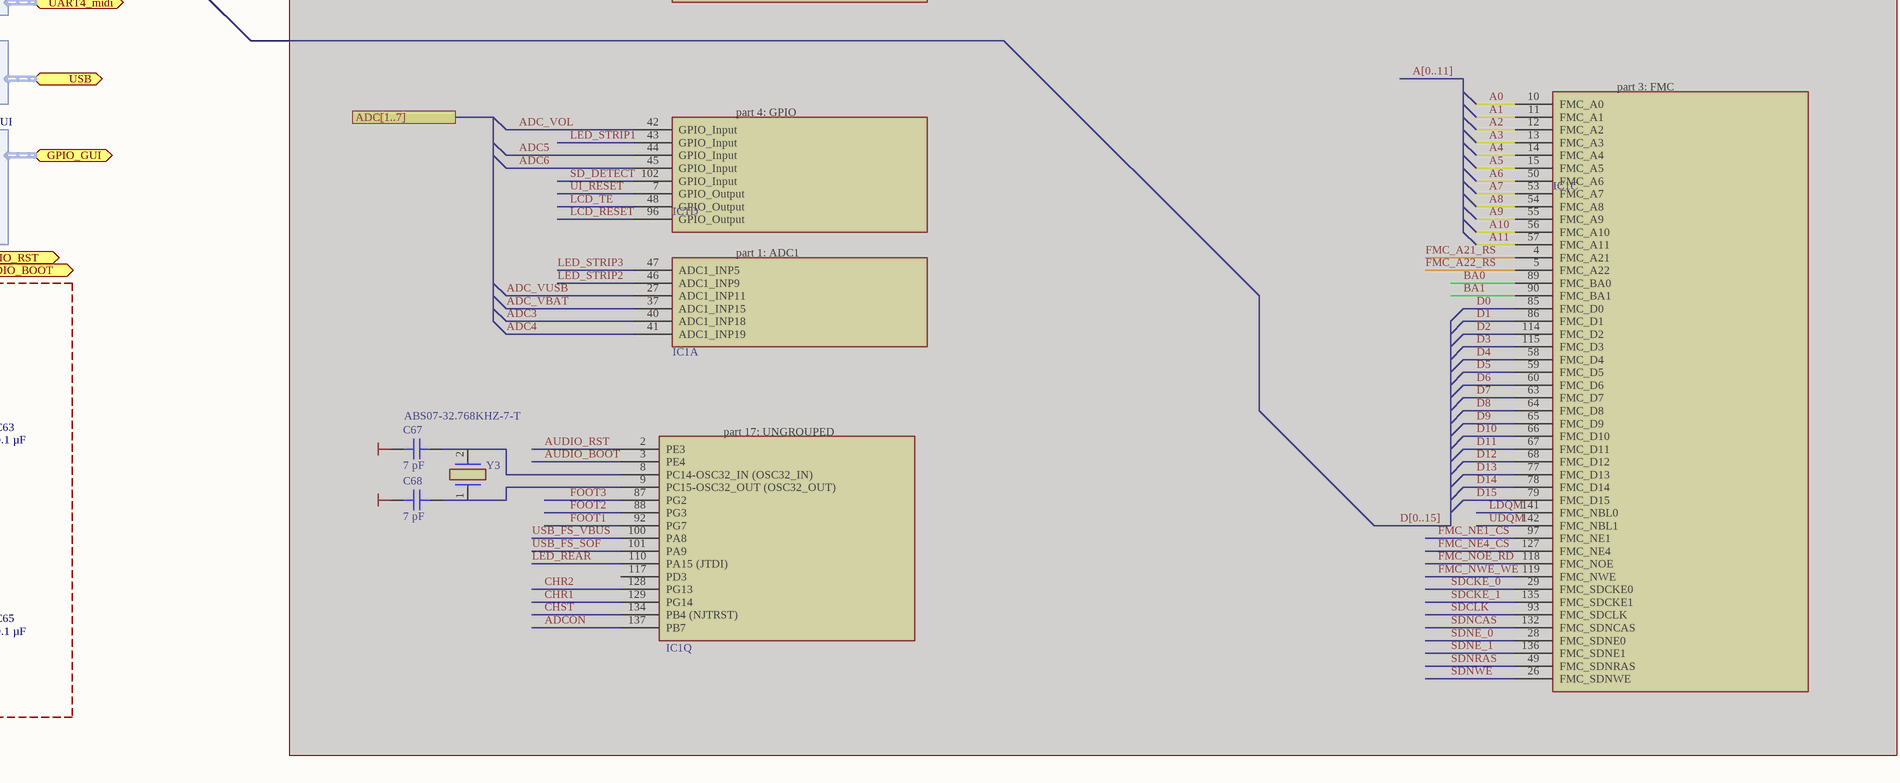
[diagram p8: MCU_GUI.SchDoc, bottom right]

### Parts
(Parts that share a designator on the sheet are numbered #1, #2 ... from top to bottom, then left to right.)
C1#1  2.2 µF  [CAP 0805_2012]
C1#2  2.2 µF  [CAP 0805_2012]  (masked out: inside a compile mask, not in the netlist)
C3#1  9pF  [CAP 0805_2012]  (masked out: inside a compile mask, not in the netlist)
C3#2  9pF  [CAP 0805_2012]
C5#1  9pF  [CAP 0805_2012]  (masked out: inside a compile mask, not in the netlist)
C5#2  9pF  [CAP 0805_2012]
C7#1  0.1µF  [CAP 0402_1005]  (masked out: inside a compile mask, not in the netlist)
C7#2  0.1µF  [CAP 0402_1005]
C9#1  2.2 µF  [CAP 0805_2012]  (masked out: inside a compile mask, not in the netlist)
C9#2  2.2 µF  [CAP 0805_2012]
C11#1  0.1µF  [CAP 0402_1005]  (masked out: inside a compile mask, not in the netlist)
C11#2  0.1µF  [CAP 0402_1005]
C12#1  0.1µF  [CAP 0402_1005]  (masked out: inside a compile mask, not in the netlist)
C12#2  0.1µF  [CAP 0402_1005]
C13#1  0.1µF  [CAP 0402_1005]  (masked out: inside a compile mask, not in the netlist)
C13#2  0.1µF  [CAP 0402_1005]
C14#1  0.1µF  [CAP 0402_1005]  (masked out: inside a compile mask, not in the netlist)
C14#2  0.1µF  [CAP 0402_1005]
C15#1  0.1µF  [CAP 0402_1005]  (masked out: inside a compile mask, not in the netlist)
C15#2  0.1µF  [CAP 0402_1005]
C16#1  0.1µF  [CAP 0402_1005]  (masked out: inside a compile mask, not in the netlist)
C16#2  0.1µF  [CAP 0402_1005]
C17#1  0.1µF  [CAP 0402_1005]  (masked out: inside a compile mask, not in the netlist)
C17#2  0.1µF  [CAP 0402_1005]
C18#1  0.1µF  [CAP 0402_1005]  (masked out: inside a compile mask, not in the netlist)
C18#2  0.1µF  [CAP 0402_1005]
C19#1  0.1µF  [CAP 0402_1005]  (masked out: inside a compile mask, not in the netlist)
C19#2  0.1µF  [CAP 0402_1005]
C20#1  0.1µF  [CAP 0402_1005]  (masked out: inside a compile mask, not in the netlist)
C20#2  0.1µF  [CAP 0402_1005]
C21#1  0.1µF  [CAP 0402_1005]  (masked out: inside a compile mask, not in the netlist)
C21#2  0.1µF  [CAP 0402_1005]
C33  0.1µF  [CAP 0402_1005]
C34  0.1µF  [CAP 0402_1005]
C35  0.1µF  [CAP 0402_1005]
C36  0.1µF  [CAP 0402_1005]
C37  0.1µF  [CAP 0402_1005]
C38  0.1µF  [CAP 0402_1005]
C39  0.1µF  [CAP 0402_1005]
C40  0.1µF  [CAP 0402_1005]
C41  0.1µF  [CAP 0402_1005]
C42  0.1µF  [CAP 0402_1005]
C43  0.1µF  [CAP 0402_1005]
C44  0.1µF  [CAP 0402_1005]
C45  0.1µF  [CAP 0402_1005]
C46  0.1µF  [CAP 0402_1005]
C63  0.1 µF  [CAP 0603_1608]
C65  0.1 µF  [CAP 0603_1608]
C67#1  7 pF  [CAP 0805_2012]
C67#2  7 pF  [CAP 0805_2012]  (masked out: inside a compile mask, not in the netlist)
C68#1  7 pF  [CAP 0805_2012]
C68#2  7 pF  [CAP 0805_2012]  (masked out: inside a compile mask, not in the netlist)
C76  1 µF  [CAP 0805_2012]
C87  10 µF  [CAP 0805_2012]
IC1#1  STM32H743ZIT6U  [QFP50P2200X2200X160-144N]
IC1#2  MCU_pinout_gui  [QFP50P2200X2200X160-144N]  (value not drawn)  (parts A,B,C,D,E,F,G,H,I,J,K,L,M,N,O,P,Q,R,S of 19)  (masked out: inside a compile mask, not in the netlist)
IC7  AT24C128BN-SH-B  [SOIC127P600X175-8N]
IC22  LD1117DT33TR  [TO228P972X240-3N]
IC55  N25Q128A13ESE40F  [SOIC127P790X216-8N]
J5#2  (no value)  [CON: JUMPER x2]
J8#2  (no value)  [CON: JUMPER x2]
J8#3  (no value)  [CON: JUMPER x2]  (masked out: inside a compile mask, not in the netlist)
R5#1  10 kOhms  [RES 0603_1608]  (masked out: inside a compile mask, not in the netlist)
R5#2  10 kOhms  [RES 0603_1608]
R7  10 kOhms  [RES 0603_1608]
R10  10 kOhms  [RES 0603_1608]
R13  5.6 kOhms  [RES 0603_1608]
R14  5.6 kOhms  [RES 0603_1608]  (value not drawn)
TP1  UART4_TX  [TESTPOINT_VIA]
TP2  UART4_RX  [TESTPOINT_VIA]
TP10  UART1_RX_boot  [TESTPOINT_VIA]
TP11  UART1_TX_boot  [TESTPOINT_VIA]
U1  W9812G6KH-6  [TSOP-54]
U2  W9812G6KH-6  [TSOP-54]
Y1#1  24MHz  [NDK NX3225SA]  (masked out: inside a compile mask, not in the netlist)
Y1#2  24MHz  [NDK NX3225SA]
Y3#1  ABS07-32.768KHZ-7-T  [ABS07]
Y3#2  ABS07-32.768KHZ-7-T  [ABS07]  (masked out: inside a compile mask, not in the netlist)

### Blocks framed on the sheet
MCUs LDO: C76 C87 IC22
GUI: C1#1 C3#2 C5#2 C7#2 C9#2 C11#2 C12#2 C13#2 C14#2 C15#2 C16#2 C17#2 C18#2 C19#2 C20#2 C21#2 C67#1 C68#1 IC1#1 J8#2 R5#2 Y1#2 Y3#1
SDRAM: C33-C46 R7 R10 U1 U2
TESTPOINTS: TP1 TP2 TP10 TP11

### Ports
ADC[1..7], ADC_VOL (in), AUDIO_RST (out), AUIDIO_BOOT (out), GPIO_GUI (bidir, harness GPIO_GUI), GUI_SWD (bidir, harness SWD), I2C2_ext (bidir, harness I2C), I2C4_EEPROM (bidir, harness I2C), LCD (bidir, harness LCD), LED_REAR (out), POWER (bidir, harness POWER), SD_Card (bidir, harness SD_Card), SPI1_AUDIO (bidir, harness SPI), SPI2_ext (bidir, harness SPI), SPI5_UI (bidir, harness SPI), UART2_audio (bidir, harness UART), UART4_midi (bidir, harness UART), USB (bidir, harness USB)

### Harnesses
SD_Card: CK, D0, D1, D2, D3, CMD, DET
SPI: MOSI, MISO, SCK, NSS
I2C: SCL, SDA
USB: DM, DP, VBUS, SOF
UART: RX, TX
SWD: CLK, IO, SWO, RST
POWER: V_USB, V_BAT, ADC_ON, CH_ST, CHR1, CHR2
GPIO_GUI: LED1, LED2, F1, F2, F3, F4, LED3
LCD: LCD1_CS, LCD2_CS, RESET, A21_RS, A22_RS, WE, RD, D[0..15], TE

### Nets
+5V: C76.2 IC22.3(VIN)
+MCU: C11#2.1 C12#2.1 C13#2.1 C14#2.1 C15#2.1 C16#2.1 C17#2.1 C18#2.1 C19#2.1 C20#2.1 C21#2.1 C33.1 C34.1 C35.1 C36.1 C37.1 C38.1 C39.1 C40.1 C41.1 C42.1 C43.1 C44.1 C45.1 C46.1 C63.2 C65.2 C87.2 IC1#1.17(VDD_1) IC1#1.30(VDD_2) IC1#1.32(VREF+) IC1#1.33(VDDA) IC1#1.39(VDD_3) IC1#1.52(VDD_4) IC1#1.62(VDD_5) IC1#1.72(VDD_6) IC1#1.84(VDD_7) IC1#1.108(VDD_8) IC1#1.121(VDD_9) IC1#1.131(VDD_10) IC1#1.144(VDD_11) IC7.8(VCC) IC22.4((THERMALPAD)) IC55.8(VCC) J5#2.1(IN) J8#2.4(IN) R5#2.1 R13.2 R14.2 U1.1(VDD) U1.3(VDDQ) U1.9(VDDQ) U1.14(VDD) U1.27(VDD) U1.43(VDDQ) U1.49(VDDQ) U2.1(VDD) U2.3(VDDQ) U2.9(VDDQ) U2.14(VDD) U2.27(VDD) U2.43(VDDQ) U2.49(VDDQ)
GND: C1#1.2 C3#2.1 C5#2.1 C7#2.1 C9#2.1 C11#2.2 C12#2.2 C13#2.2 C14#2.2 C15#2.2 C16#2.2 C17#2.2 C18#2.2 C19#2.2 C20#2.2 C21#2.2 C33.2 C34.2 C35.2 C36.2 C37.2 C38.2 C39.2 C40.2 C41.2 C42.2 C43.2 C44.2 C45.2 C46.2 C63.1 C65.1 C67#1.1 C68#1.1 C76.1 C87.1 IC1#1.16(VSS_1) IC1#1.31(VSSA) IC1#1.38(VSS_2) IC1#1.51(VSS_3) IC1#1.61(VSS_4) IC1#1.83(VSS_5) IC1#1.94(VSS_6) IC1#1.107(VSS_7) IC1#1.120(VSS_8) IC1#1.130(VSS_9) IC7.7(WP) IC22.1(GND) IC55.4(VSS) J5#2.3(IN) J8#2.2(IN) R7.1 R10.1 U1.6(VSSQ) U1.12(VSSQ) U1.28(VSS) U1.41(VSS) U1.46(VSSQ) U1.52(VSSQ) U1.54(VSS) U2.6(VSSQ) U2.12(VSSQ) U2.28(VSS) U2.41(VSS) U2.46(VSSQ) U2.52(VSSQ) U2.54(VSS) Y1#2.2(GND) Y1#2.4(GND)
A0: IC1#1.10(PF0) U1.23(A0) U2.23(A0)  [project net A0_6]
A1: IC1#1.11(PF1) U1.24(A1) U2.24(A1)  [project net A1_6]
A2: IC1#1.12(PF2) U1.25(A2) U2.25(A2)  [project net A2_6]
A3: IC1#1.13(PF3) U1.26(A3) U2.26(A3)  [project net A3_6]
A4: IC1#1.14(PF4) U1.29(A4) U2.29(A4)  [project net A4_6]
A5: IC1#1.15(PF5) U1.30(A5) U2.30(A5)  [project net A5_6]
A6: IC1#1.50(PF12) U1.31(A6) U2.31(A6)  [project net A6_6]
A7: IC1#1.53(PF13) U1.32(A7) U2.32(A7)  [project net A7_6]
A8: IC1#1.54(PF14) U1.33(A8) U2.33(A8)  [project net A8_6]
A9: IC1#1.55(PF15) U1.34(A9) U2.34(A9)  [project net A9_6]
A10: IC1#1.56(PG0) U1.22(A10/AP) U2.22(A10/AP)  [project net A10_6]
A11: IC1#1.57(PG1) U1.35(A11) U2.35(A11)  [project net A11_6]
ADC3: IC1#1.40(PA4)  [project net ADC3_6]
ADC4: IC1#1.41(PA5)  [project net ADC4_6]
ADC5: IC1#1.44(PC4)  [project net ADC5_6]
ADC6: IC1#1.45(PC5)  [project net ADC6_6]
ADC_VBAT: IC1#1.37(PA3) ; port POWER.V_BAT
ADC_VOL: IC1#1.42(PA6) ; port ADC_VOL
ADC_VUSB: IC1#1.27(PC1) ; port POWER.V_USB
ADCON: IC1#1.137(PB7) TP10.1 ; port POWER.ADC_ON  [project net ADC_ON]
AUDIO_BOOT: IC1#1.3(PE4) ; port AUIDIO_BOOT
AUDIO_RST: IC1#1.2(PE3) ; port AUDIO_RST
BA0: IC1#1.89(PG4) U1.20(BS0) U2.20(BS0)  [project net BA0_6]
BA1: IC1#1.90(PG5) U1.21(BS1) U2.21(BS1)  [project net BA1_6]
CHR1: IC1#1.129(PG14) ; port POWER.CHR1
CHR2: IC1#1.128(PG13) ; port POWER.CHR2
CHST: IC1#1.134(PB4) ; port POWER.CH_ST  [project net CHARGE_STATUS]
D0: IC1#1.85(PD14) U1.2(DQ0) U2.2(DQ0)
D1: IC1#1.86(PD15) U1.4(DQ1) U2.4(DQ1)
D2: IC1#1.114(PD0) U1.5(DQ2) U2.5(DQ2)
D3: IC1#1.115(PD1) U1.7(DQ3) U2.7(DQ3)
D4: IC1#1.58(PE7) U1.8(DQ4) U2.8(DQ4)
D5: IC1#1.59(PE8) U1.10(DQ5) U2.10(DQ5)
D6: IC1#1.60(PE9) U1.11(DQ6) U2.11(DQ6)
D7: IC1#1.63(PE10) U1.13(DQ7) U2.13(DQ7)
D8: IC1#1.64(PE11) U1.42(DQ8) U2.42(DQ8)
D9: IC1#1.65(PE12) U1.44(DQ9) U2.44(DQ9)
D10: IC1#1.66(PE13) U1.45(DQ10) U2.45(DQ10)
D11: IC1#1.67(PE14) U1.47(DQ11) U2.47(DQ11)
D12: IC1#1.68(PE15) U1.48(DQ12) U2.48(DQ12)
D13: IC1#1.77(PD8) U1.50(DQ13) U2.50(DQ13)
D14: IC1#1.78(PD9) U1.51(DQ14) U2.51(DQ14)
D15: IC1#1.79(PD10) U1.53(DQ15) U2.53(DQ15)
FLASH_CLK: IC1#1.22(PF10) IC55.6(C)  [project net FLASH_CLK_6]
FLASH_CS: IC1#1.91(PG6) IC55.1(S#)  [project net FLASH_CS_6]
FLASH_D0: IC1#1.80(PD11) IC55.5(DQ0)  [project net FLASH_D0_6]
FLASH_D1: IC1#1.81(PD12) IC55.2(DQ1)  [project net FLASH_D1_6]
FLASH_D2: IC1#1.1(PE2) IC55.3(W#/VPP/DQ2)  [project net FLASH_D2_6]
FLASH_D3: IC1#1.82(PD13) IC55.7(HOLD#/DQ3)  [project net FLASH_D3_6]
FMC_A21_RS: IC1#1.4(PE5) ; port LCD.A21_RS
FMC_A22_RS: IC1#1.5(PE6) ; port LCD.A22_RS
FMC_NE1_CS: IC1#1.97(PC7) ; port LCD.LCD1_CS
FMC_NE4_CS: IC1#1.127(PG12) ; port LCD.LCD2_CS
FMC_NOE_RD: IC1#1.118(PD4) ; port LCD.RD
FMC_NWE_WE: IC1#1.119(PD5) ; port LCD.WE
FOOT1: IC1#1.92(PG7) ; port GPIO_GUI.F1
FOOT2: IC1#1.88(PG3) ; port GPIO_GUI.F2
FOOT3: IC1#1.87(PG2) ; port GPIO_GUI.F3
GUI_NRST: C7#2.2 IC1#1.25(NRST) R5#2.2 ; port GUI_SWD.RST
I2C1_SCL: IC1#1.139(PB8) IC7.6(SCL) R13.1  [project net I2C1_SCL_6]
I2C1_SDA: IC1#1.140(PB9) IC7.5(SDA) R14.1  [project net I2C1_SDA_6]
I2C2_SCL: IC1#1.69(PB10) ; port I2C2_ext.SCL
I2C2_SDA: IC1#1.70(PB11) ; port I2C2_ext.SDA
JTAG_SWCLK: IC1#1.109(PA14) ; port GUI_SWD.CLK  [project net GUI_SWD.CLK]
JTAG_SWDIO: IC1#1.105(PA13) ; port GUI_SWD.IO  [project net GUI_SWD.IO]
JTAG_SWO: IC1#1.133(PB3) ; port GUI_SWD.SWO  [project net GUI_SWD.SWO]
LCD_RESET: IC1#1.96(PC6) ; port LCD.RESET
LCD_TE: IC1#1.48(PB2) ; port LCD.TE
LDQM: IC1#1.141(PE0) R7.2 U1.15(LDQM) U2.15(LDQM)  [project net LDQM_6]
LED_REAR: IC1#1.110(PA15) ; port LED_REAR
LED_STRIP1: IC1#1.43(PA7) ; port GPIO_GUI.LED1  [project net GPIO_GUI.LED1]
LED_STRIP2: IC1#1.46(PB0) ; port GPIO_GUI.LED2  [project net GPIO_GUI.LED2]
LED_STRIP3: IC1#1.47(PB1) ; port GPIO_GUI.LED3  [project net GPIO_GUI.LED3]
SD_CK: IC1#1.113(PC12) ; port SD_Card.CK
SD_CMD: IC1#1.116(PD2) ; port SD_Card.CMD
SD_D0: IC1#1.98(PC8) ; port SD_Card.D0
SD_D1: IC1#1.99(PC9) ; port SD_Card.D1
SD_D2: IC1#1.111(PC10) ; port SD_Card.D2
SD_D3: IC1#1.112(PC11) ; port SD_Card.D3
SD_DETECT: IC1#1.102(PA10) ; port SD_Card.DET
SDCKE_0: IC1#1.29(PC3_C) U1.37(CKE)  [project net SDCKE_0_6]
SDCKE_1: IC1#1.135(PB5) U2.37(CKE)  [project net SDCKE_1_6]
SDCLK: IC1#1.93(PG8) U1.38(CLK) U2.38(CLK)  [project net SDCLK_6]
SDNCAS: IC1#1.132(PG15) U1.17(NCAS) U2.17(NCAS)  [project net SDNCAS_6]
SDNE_0: IC1#1.28(PC2_C) U1.19(NCS)  [project net SDNE_0_6]
SDNE_1: IC1#1.136(PB6) U2.19(NCS)  [project net SDNE_1_6]
SDNRAS: IC1#1.49(PF11) U1.18(NRAS) U2.18(NRAS)  [project net SDNRAS_6]
SDNWE: IC1#1.26(PC0) U1.16(NWE) U2.16(NWE)  [project net SDNWE_6]
SPI1_MISO: IC1#1.124(PG9) ; port SPI1_AUDIO.MISO
SPI1_MOSI: IC1#1.123(PD7) ; port SPI1_AUDIO.MOSI
SPI1_NSS: IC1#1.125(PG10) ; port SPI1_AUDIO.NSS
SPI1_SCK: IC1#1.126(PG11) ; port SPI1_AUDIO.SCK
SPI2_MISO: IC1#1.75(PB14) ; port SPI2_ext.MISO  [project net SPI2_ext.MISO]
SPI2_MOSI: IC1#1.76(PB15) ; port SPI2_ext.MOSI  [project net SPI2_ext.MOSI]
SPI2_NSS: IC1#1.73(PB12) ; port SPI2_ext.NSS  [project net SPI2_ext.NSS]
SPI2_SCK: IC1#1.74(PB13) ; port SPI2_ext.SCK  [project net SPI2_ext.SCK]
SPI5_MISO: IC1#1.20(PF8) ; port SPI5_UI.MISO
SPI5_MOSI: IC1#1.21(PF9) ; port SPI5_UI.MOSI
SPI5_NSS: IC1#1.18(PF6) ; port SPI5_UI.NSS
SPI5_SCK: IC1#1.19(PF7) ; port SPI5_UI.SCK
UART2_RX: IC1#1.122(PD6) ; port UART2_audio.RX  [project net UART1_RX]
UART2_TX: IC1#1.36(PA2) ; port UART2_audio.TX  [project net UART1_TX]
UART4_RX: IC1#1.35(PA1) TP2.1 ; port UART4_midi.RX
UART4_TX: IC1#1.34(PA0) TP1.1 ; port UART4_midi.TX
UDQM: IC1#1.142(PE1) R10.2 U1.39(UDQM) U2.39(UDQM)  [project net UDQM_6]
USB_FS_DM: IC1#1.103(PA11) ; port USB.DM
USB_FS_DP: IC1#1.104(PA12) ; port USB.DP
USB_FS_SOF: IC1#1.100(PA8) ; port USB.SOF
USB_FS_VBUS: IC1#1.101(PA9) TP11.1 ; port USB.VBUS
NetC1#1_1: C1#1.1 IC1#1.106(VCAP_2)
NetC3#2_2: C3#2.2 IC1#1.23(PH0-OSC_IN) Y1#2.1
NetC5#2_2: C5#2.2 IC1#1.24(PH1-OSC_OUT) Y1#2.3
NetC9#2_2: C9#2.2 IC1#1.71(VCAP_1)
NetC67#1_2: C67#1.2 IC1#1.8(PC14-OSC32_IN) Y3#1.2
NetC68#1_2: C68#1.2 IC1#1.9(PC15-OSC32_OUT) Y3#1.1
NetIC1#1_138: IC1#1.138(BOOT0) J8#2.1(IN) J8#2.3(IN)
NetIC7_1: IC7.1(A0) J5#2.2(IN) J5#2.4(IN)
NetIC7_2: IC7.2(A1) IC7.3(A2) IC7.4(GND)

Not connected (* = marked no-connect by the designer): IC1#1 6(VBAT) 7(PC13) 95(VDD33USB) 117(PD3) 143(PDR_ON); U1 36(NC) 40(NC); U2 36(NC) 40(NC)

### Buses and harness runs
bus A[0..11]
bus D[0..15]

### Notes on the sheet
- I2C EEPROM
- SPI to AUIDIO
- Debug
- PB8	I2C4_SCL
  PB9	I2C4_SDA
- PG9	SPI1_MISO
  PD7	SPI1_MOSI
  PG10	SPI1_NSS
  PG11	SPI1_SCK
- PD11	QUADSPI_BK1_IO0
  PD12	QUADSPI_BK1_IO1
  PE2	QUADSPI_BK1_IO2
  PD13	QUADSPI_BK1_IO3
  PG6	QUADSPI_BK1_NCS
  PF10	QUADSPI_CLK
- PB4 	DEBUG_JTRST
  PB3 	DEBUG_JTDO-SWO
  PA15 	DEBUG_JTDI
  PA14 	DEBUG_JTCK-SWCLK
  PA13 	DEBUG_JTMS-SWDIO
  GUI_NRST
- (near J8#2) FF
- (near J8#2) NF
- PC8	SDMMC1_D0
  PC9	SDMMC1_D1
  PC10	SDMMC1_D2
  PC11	SDMMC1_D3
  PC12	SDMMC1_CK
  PD2	SDMMC1_CMD
- PC13-	MY_UI_RESET
  PC6	MY_LCD_RESET
  PA10	MY_SD_DETECT
- PF8	SPI5_MISO
  PF9	SPI5_MOSI
  PF6	SPI5_NSS
  PF7	SPI5_SCK
- (near R5#1) NF
- PA3	ADC1_INP15
  PA4	ADC1_INP18
  PA5	ADC1_INP19
  PA6	ADC1_INP3
  PA7	ADC1_INP7
  PB0	ADC1_INP9
  PB1	ADC1_INP5
  PC1	ADC1_INP11
  PC4	ADC1_INP4
  PC5	ADC1_INP8
- (near J8#3) FF
- (near J8#3) NF
- SPI to UI
- PA11	USB_OTG_FS_DM
  PA12	USB_OTG_FS_DP
  PA8	USB_OTG_FS_SOF
  PA9	USB_OTG_FS_VBUS
- (near R5#2) NF
- Disp SPI optional
- SPI external (optional)
- (near C7#2) PA0	UART4_TX
  PA1	UART4_RX
- (near C7#2) UART4 Debug
- PB14	SPI2_MISO
  PB15	SPI2_MOSI
  PB12	SPI2_NSS
  PB13	SPI2_SCK
- PA2	USART2_TX
  PD6	USART2_RX
- UART2 Audio
- PF0	FMC_A0
  PF1	FMC_A1
  PF2	FMC_A2
  PF3	FMC_A3
  PF4	FMC_A4
  PF5	FMC_A5
  PF12	FMC_A6
  PF13	FMC_A7
  PF14	FMC_A8
  PF15	FMC_A9
  PG0	FMC_A10
  PG1	FMC_A11
  PE5	FMC_A21
  PE6	FMC_A22
  PG4	FMC_BA0
  PG5	FMC_BA1
  PD14	FMC_D0
  PD15	FMC_D1
  PD0	FMC_D2
  PD1	FMC_D3
  PE7	FMC_D4
  PE8	FMC_D5
  PE9	FMC_D6
  PE10	FMC_D7
  PE11	FMC_D8
  PE12	FMC_D9
  PE13	FMC_D10
  PE14	FMC_D11
  PE15	FMC_D12
  PD8	FMC_D13
  PD9	FMC_D14
  PD10	FMC_D15
  PE0	FMC_NBL0
  PE1	FMC_NBL1
  PC7	FMC_NE1
  PG12	FMC_NE4
  PD4	FMC_NOE
  PD5	FMC_NWE
  PC3_C	FMC_SDCKE0
  PB5	FMC_SDCKE1
  PG8	FMC_SDCLK
  PG15	FMC_SDNCAS
  PC2_C	FMC_SDNE0
  PB6	FMC_SDNE1
- PB10	I2C2_SCL
  PB11	I2C2_SDA
- I2C external + display
- MEMORY
- (near IC55) FLASH
- (near J5#2) NF
- (near IC7) EEPROM
- (near R13) FF
- (near R14) FF
- (near U1) Or HY57V64820HGT
- (near U2) Or HY57V64820HGT
- (in symbol MCU_pinout_gui, part A) part 1: ADC1
- (in symbol MCU_pinout_gui, part B) part 2: DEBUG
- (in symbol MCU_pinout_gui, part C) part 3: FMC
- (in symbol MCU_pinout_gui, part D) part 4: GPIO
- (in symbol MCU_pinout_gui, part E) part 5: GROUND
- (in symbol MCU_pinout_gui, part F) part 6: I2C1
- (in symbol MCU_pinout_gui, part G) part 7: I2C2
- (in symbol MCU_pinout_gui, part H) part 8: POWER
- (in symbol MCU_pinout_gui, part I) part 9: POWER_SPECIAL
- (in symbol MCU_pinout_gui, part J) part 10: QUADSPI
- (in symbol MCU_pinout_gui, part K) part 11: RCC
- (in symbol MCU_pinout_gui, part L) part 12: SDMMC1
- (in symbol MCU_pinout_gui, part M) part 13: SPI1
- (in symbol MCU_pinout_gui, part N) part 14: SPI2
- (in symbol MCU_pinout_gui, part O) part 15: SPI5
- (in symbol MCU_pinout_gui, part P) part 16: UART4
- (in symbol MCU_pinout_gui, part Q) part 17: UNGROUPED
- (in symbol MCU_pinout_gui, part R) part 18: USART2
- (in symbol MCU_pinout_gui, part S) part 19: USB

### Library data of the parts
C1#1 C1#2 C9#1 C9#2 = C0805C225K8RAC7800: CAP CER 2.2UF 10V X7R 0805; manufacturer: KEMET; Tolerance: ±10%; Part Number: C0805C225K8RAC7800; Value: 2.2 µF; Applications: Bypass, Decoupling; Capacitance: 2.2 µF; componentlink1description: Datasheet; componentlink1url: https://api.kemet.com/component-edge/download/datasheet/C0805C225K8RACTU.pdf; componentlink2description: DigiKey Link; componentlink2url: https://www.digikey.com/en/products/detail/kemet/C0805C225K8RAC7800/789654; Device Package: 0805 (2012 Metric); lastupdated: 3/27/2023 7:09:32 PM; Lifecycle Status: Active; Minimum Order: 1; Mounting Type: Surface Mount, MLCC; Operating Temperature: -55°C ~ 125°C; Package / Case: 0805 (2012 Metric); packaging: TapeAndReel; partid: 32363; Part Status: Active; price: 0.03; series: SMD Comm X7R; Size / Dimension: 0.079" L x 0.049" W (2.00mm x 1.25mm); Supplier 1: DigiKey; Supplier Part Number 1: 399-C0805C225K8RAC7800CT-ND; Temperature Coefficient: X7R; Thickness (Max): 0.055" (1.40mm); Voltage - Rated: 10V
C3#1 C3#2 C5#1 C5#2 = CBR08C909CAGAC: CAP CER 9PF 250V C0G/NP0 0805; Manufacturer: KEMET; Temperature Coefficient: C0G, NP0; Tolerance: ±0.25pF; Part Number: CBR08C909CAGAC; Value: 9pF; Applications: RF, Microwave, High Frequency; Capacitance: 9pF; ComponentLink1Description: Datasheet; ComponentLink1URL: https://api.kemet.com/component-edge/download/datasheet/CBR08C909CAGAC.pdf; ComponentLink2Description: DigiKey Link; ComponentLink2URL: http://digikey.com/product-detail/en/kemet/CBR08C909CAGAC/399-8711-1-ND/3480335; Device Package: 0805 (2012 Metric); Features: High Q, Low Loss, Ultra Low ESR; LastUpdated: 9/2/2020 1:04:31 AM; Lifecycle Status: Active; Minimum Order: 1; Mounting Type: Surface Mount, MLCC; Operating Temperature: -55°C ~ 125°C; Package / Case: 0805 (2012 Metric); Packaging: TapeAndReel; PartId: 8592; Part Status: Active; Price: 0.28; Series: CBR-SMD RF C0G; Size / Dimension: 0.079" L x 0.049" W (2.00mm x 1.25mm); Supplier 1: DigiKey; Supplier Part Number 1: 399-8711-1-ND; Thickness (Max): 0.035" (0.88mm); Voltage - Rated: 250V
C7#1 C7#2 C11#1 C11#2 C12#1 C12#2 C13#1 C13#2 C14#1 C14#2 C15#1 C15#2 C16#1 C16#2 C17#1 C17#2 C18#1 C18#2 C19#1 C19#2 C20#1 C20#2 C21#1 C21#2 C33-C46 = C0402C104K4RACAUTO: CAP CER 0.1UF 16V X7R 0402; Manufacturer: KEMET; Tolerance: ±10%; Part Number: C0402C104K4RACAUTO; Value: 0.1µF; Applications: Automotive, Bypass, Decoupling; Capacitance: 0.1µF; ComponentLink1Description: Datasheet; ComponentLink1URL: https://api.kemet.com/component-edge/download/specsheet/C0402C104K4RACAUTO.pdf; ComponentLink2Description: DigiKey Link; ComponentLink2URL: http://digikey.com/product-detail/en/kemet/C0402C104K4RACAUTO/399-6828-1-ND/3314343; Device Package: 0402 (1005 Metric); LastUpdated: 9/2/2020 1:02:21 AM; Lifecycle Status: Active; Minimum Order: 1; Mounting Type: Surface Mount, MLCC; Operating Temperature: -55°C ~ 125°C; Package / Case: 0402 (1005 Metric); Packaging: TapeAndReel; PartId: 3024; Part Status: Active; Price: 0.01; Ratings: AEC-Q200; Series: SMD Auto X7R; Size / Dimension: 0.039" L x 0.020" W (1.00mm x 0.50mm); Supplier 1: DigiKey; Supplier Part Number 1: 399-6828-1-ND; Temperature Coefficient: X7R; Thickness (Max): 0.022" (0.55mm); Voltage - Rated: 16V
C63 C65 = C0603C104K5RAC7411: CAP CER 0.1UF 50V X7R 0603; manufacturer: KEMET; Tolerance: ±10%; Part Number: C0603C104K5RAC7411; Value: 0.1 µF; Applications: Bypass, Decoupling; Capacitance: 0.1 µF; componentlink1description: Datasheet; componentlink1url: https://api.kemet.com/component-edge/download/datasheet/C0603C104K5RAC7411.pdf; componentlink2description: DigiKey Link; componentlink2url: https://www.digikey.com/en/products/detail/kemet/C0603C104K5RAC7411/3317013; Device Package: 0603 (1608 Metric); lastupdated: 2/9/2024 8:10:30 PM; Lifecycle Status: Active; Minimum Order: 1; Mounting Type: Surface Mount, MLCC; Operating Temperature: -55°C ~ 125°C; Package / Case: 0603 (1608 Metric); packaging: TapeAndReel; partid: 2233; Part Status: Active; price: 0.01; series: SMD Comm X7R; Size / Dimension: 0.063" L x 0.031" W (1.60mm x 0.80mm); Supplier 1: DigiKey; Supplier Part Number 1: 399-C0603C104K5RAC7411CT-ND; Temperature Coefficient: X7R; Thickness (Max): 0.035" (0.90mm); Voltage - Rated: 50V
C67#1 C67#2 C68#1 C68#2 = CC0805DRNPO9BN7R0: CAP CER 7PF 50V C0G/NPO 0805; manufacturer: Yageo; Temperature Coefficient: C0G, NP0; Tolerance: ±0.5pF; Part Number: CC0805DRNPO9BN7R0; Value: 7 pF; Applications: General Purpose; Capacitance: 7 pF; componentlink1description: Datasheet; componentlink1url: https://www.yageo.com/upload/media/product/productsearch/datasheet/mlcc/UPY-GP_NP0_16V-to-50V_17.pdf; componentlink2description: DigiKey Link; componentlink2url: https://www.digikey.com/en/products/detail/yageo/CC0805DRNPO9BN7R0/302830; Device Package: 0805 (2012 Metric); lastupdated: 9/8/2023 7:12:10 PM; Lifecycle Status: Active; Minimum Order: 1; Mounting Type: Surface Mount, MLCC; Operating Temperature: -55°C ~ 125°C; Package / Case: 0805 (2012 Metric); packaging: TapeAndReel; partid: 8360; Part Status: Active; price: 0.01; series: CC; Size / Dimension: 0.079" L x 0.049" W (2.00mm x 1.25mm); Supplier 1: DigiKey; Supplier Part Number 1: 311-1096-1-ND; Thickness (Max): 0.024" (0.60mm); Voltage - Rated: 50V
C76 = C0805C105K4RAC7800: CAP CER 1UF 16V X7R 0805; manufacturer: KEMET; Tolerance: ±10%; Part Number: C0805C105K4RAC7800; Value: 1 µF; Applications: Bypass, Decoupling; Capacitance: 1 µF; componentlink1description: Datasheet; componentlink1url: https://api.kemet.com/component-edge/download/datasheet/C0805C105K4RACTU.pdf; componentlink2description: DigiKey Link; componentlink2url: https://www.digikey.com/en/products/detail/kemet/C0805C105K4RAC7800/416047; Device Package: 0805 (2012 Metric); lastupdated: 9/19/2022 1:03:30 PM; Lifecycle Status: Active; Minimum Order: 1; Mounting Type: Surface Mount, MLCC; Operating Temperature: -55°C ~ 125°C; Package / Case: 0805 (2012 Metric); packaging: TapeAndReel; partid: 32075; Part Status: Active; price: 0.01; series: SMD Comm X7R; Size / Dimension: 0.079" L x 0.049" W (2.00mm x 1.25mm); Supplier 1: DigiKey; Supplier Part Number 1: 399-C0805C105K4RAC7800CT-ND; Temperature Coefficient: X7R; Thickness (Max): 0.039" (1.00mm); Voltage - Rated: 16V
C87 = C0805C106K8PAC7800: CAP CER 10UF 10V X5R 0805; manufacturer: KEMET; Tolerance: ±10%; Part Number: C0805C106K8PAC7800; Value: 10 µF; Applications: Bypass, Decoupling; Capacitance: 10 µF; componentlink1description: Datasheet; componentlink1url: https://connect.kemet.com:7667/gateway/IntelliData-ComponentDocumentation/1.0/download/datasheet/C0805C106K8PACTU; componentlink2description: DigiKey Link; componentlink2url: https://www.digikey.com/en/products/detail/kemet/C0805C106K8PAC7800/1090830; Device Package: 0805 (2012 Metric); lastupdated: 9/14/2022 7:51:56 AM; Lifecycle Status: Active; Minimum Order: 1; Mounting Type: Surface Mount, MLCC; Operating Temperature: -55°C ~ 85°C; Package / Case: 0805 (2012 Metric); packaging: TapeAndReel; partid: 44790; Part Status: Active; price: 0.02; series: SMD Comm X5R; Size / Dimension: 0.079" L x 0.049" W (2.00mm x 1.25mm); Supplier 1: DigiKey; Supplier Part Number 1: 399-C0805C106K8PAC7800CT-ND; Temperature Coefficient: X5R; Thickness (Max): 0.055" (1.40mm); Voltage - Rated: 10V
IC1#1 = STM32H743ZIT6U: Integrated Circuit; Manufacturer_Name: STMicroelectronics; Datasheet Link: https://componentsearchengine.com/Datasheets/1/STM32H743ZIT6U.pdf; Height: 1.6mm; Manufacturer_Part_Number: STM32H743ZIT6U; Mouser Part Number: N/A; Mouser Price/Stock: https://www.mouser.co.uk/ProductDetail/STMicroelectronics/STM32H743ZIT6U?qs=PzGy0jfpSMtTUBlZwwPqMQ%3D%3D
IC1#2 = MCU_pinout_gui: MCU with 144 pins / Grouped by function
IC7 = AT24C128BN-SH-B: Integrated Circuit; Manufacturer_Name: Microchip; Datasheet Link: https://componentsearchengine.com/Datasheets/1/AT24C128BN-SH-B.pdf; Height: 1.75mm; Manufacturer_Part_Number: AT24C128BN-SH-B; Mouser Part Number: 556-A24C128BNSH-B; Mouser Price/Stock: https://www.mouser.co.uk/ProductDetail/Microchip-Technology-Atmel/AT24C128BN-SH-B?qs=j6lVIf5KywAfpl9r4qbAuQ%3D%3D
IC22 = LD1117DT33TR: Integrated Circuit; Manufacturer_Name: STMicroelectronics; Datasheet Link: http://www.st.com/web/en/resource/technical/document/datasheet/CD00000544.pdf; Height: 2.4mm; Manufacturer_Part_Number: LD1117DT33TR; Mouser Part Number: 511-LD1117DT33-TR; Mouser Price/Stock: https://www.mouser.co.uk/ProductDetail/STMicroelectronics/LD1117DT33TR?qs=4JhUBQGAOSd4P5jVYGxp2g%3D%3D; Arrow Part Number: LD1117DT33TR; Arrow Price/Stock: https://www.arrow.com/en/products/ld1117dt33tr/stmicroelectronics?region=nac
IC55 = N25Q128A13ESE40F: Integrated Circuit; Manufacturer_Name: Micron; Datasheet Link: https://datasheet.datasheetarchive.com/originals/distributors/Datasheets-DGA23/1494983.pdf; Height: 2.16mm; Manufacturer_Part_Number: N25Q128A13ESE40F; Mouser Part Number: 340-182267; Mouser Price/Stock: https://www.mouser.co.uk/ProductDetail/Micron/N25Q128A13ESE40F?qs=taEdVNyAfdHw8xv9Y4zfpQ%3D%3D; Arrow Part Number: N25Q128A13ESE40F; Arrow Price/Stock: https://www.arrow.com/en/products/n25q128a13ese40f/micron-technology
J5#2 J8#2 J8#3 = Jumper_double: CommentText: "Перемычка"
R5#1 R5#2 R7 R10 = ERJ-3EKF1002V: RES SMD 10K OHM 1% 1/10W 0603; Manufacturer: Panasonic Electronic Components; Power (Watts): 0.1W, 1/10W; Temperature Coefficient: ±100ppm/°C; Part Number: ERJ-3EKF1002V; Value: 10 kOhms; ComponentLink1Description: Datasheet; ComponentLink1URL: https://industrial.panasonic.com/cdbs/www-data/pdf/RDA0000/AOA0000C304.pdf; ComponentLink2Description: DigiKey Link; ComponentLink2URL: https://www.digikey.com/en/products/detail/panasonic-electronic-components/ERJ-3EKF1002V/196066; Composition: Thick Film; Device Package: 0603 (1608 Metric); Height - Seated (Max): 0.022" (0.55mm); LastUpdated: 2/9/2024 8:41:59 PM; Lifecycle Status: Active; Minimum Order: 1; Number of Terminations: 2; Operating Temperature: -55°C ~ 155°C; Package / Case: 0603 (1608 Metric); Packaging: TapeAndReel; PartId: 25695; Part Status: Active; Price: 0.01; Resistance: 10 kOhms; Series: ERJ-3EK; Size / Dimension: 0.063" L x 0.031" W (1.60mm x 0.80mm); Supplier 1: DigiKey; Supplier Part Number 1: P10.0KHCT-ND; Supplier Device Package: 0603; Tolerance: ±1%; Features: Automotive AEC-Q200; Ratings: AEC-Q200
R13 R14 = RT0603DRE075K6L: RES SMD 5.6K OHM 0.5% 1/10W 0603; Manufacturer: Yageo; Power (Watts): 0.1W, 1/10W; Temperature Coefficient: ±50ppm/°C; Part Number: RT0603DRE075K6L; Value: 5.6 kOhms; ComponentLink1Description: Datasheet; ComponentLink1URL: https://www.yageo.com/upload/media/product/productsearch/datasheet/rchip/PYu-RT_1-to-0.01_RoHS_L_11.pdf; ComponentLink2Description: DigiKey Link; ComponentLink2URL: http://digikey.com/product-detail/en/yageo/RT0603DRE075K6L/311-2635-1-ND/6129054; Composition: Thin Film; Device Package: 0603 (1608 Metric); Height - Seated (Max): 0.022" (0.55mm); LastUpdated: 9/2/2020 1:10:05 AM; Lifecycle Status: Active; Minimum Order: 1; Number of Terminations: 2; Operating Temperature: -55°C ~ 155°C; Package / Case: 0603 (1608 Metric); Packaging: TapeAndReel; PartId: 14197; Part Status: Active; Price: 0.01; Resistance: 5.6 kOhms; Series: RT; Size / Dimension: 0.063" L x 0.031" W (1.60mm x 0.80mm); Supplier 1: DigiKey; Supplier Part Number 1: 311-2635-1-ND; Supplier Device Package: 0603; Tolerance: ±0.5%
TP1 TP2 TP10 TP11 = TestPoint
Y1#1 Y1#2 = NX3225SA-24MHZ-EXS00A-CS07532: CRYSTAL 24MHZ 9PF SMD; Manufacturer: NDK America, Inc.; ESR (Equivalent Series Resistance): 100 Ohms; Operating Mode: Fundamental; Part Number: NX3225SA-24MHZ-EXS00A-CS07532; ComponentLink2Description: DigiKey Link; ComponentLink2URL: http://digikey.com/product-detail/en/ndk-america-inc/NX3225SA-24MHZ-EXS00A-CS07532/644-1393-1-ND/9172121; Frequency: 24MHz; Height - Seated (Max): 0.024" (0.60mm); LastUpdated: 9/2/2020 1:21:59 AM; Lifecycle Status: Active; Load Capacitance: 9pF; Minimum Order: 1; Mounting Type: Surface Mount; Operating Temperature: -40°C ~ 150°C; Package / Case: 4-SMD, No Lead; Packaging: TapeAndReel; PartId: 571; Part Status: Active; Price: 0.38; Ratings: AEC-Q200; Series: NX3225SA; Size / Dimension: 0.126" L x 0.098" W (3.20mm x 2.50mm); Supplier 1: DigiKey; Supplier Part Number 1: 644-1393-1-ND; Type: MHz Crystal; Value: 24MHz
Y3#1 Y3#2 = ABS07-32.768KHZ-7-T: Crystal or Oscillator; Manufacturer_Name: ABRACON; Datasheet Link: https://abracon.com/Resonators/ABS07.pdf; Height: 0.9mm; Manufacturer_Part_Number: ABS07-32.768KHZ-7-T; Mouser Part Number: 815-ABS07-32.768K7T; Mouser Price/Stock: https://www.mouser.co.uk/ProductDetail/ABRACON/ABS07-32.768KHZ-7-T?qs=2nyfZ6BV3oibNEFok2qBLA%3D%3D; Arrow Part Number: ABS07-32.768KHZ-7-T; Arrow Price/Stock: https://www.arrow.com/en/products/abs07-32.768khz-7-t/abracon?region=nac